# Altium project MainBoard.PrjPCB (part 1 of 2)
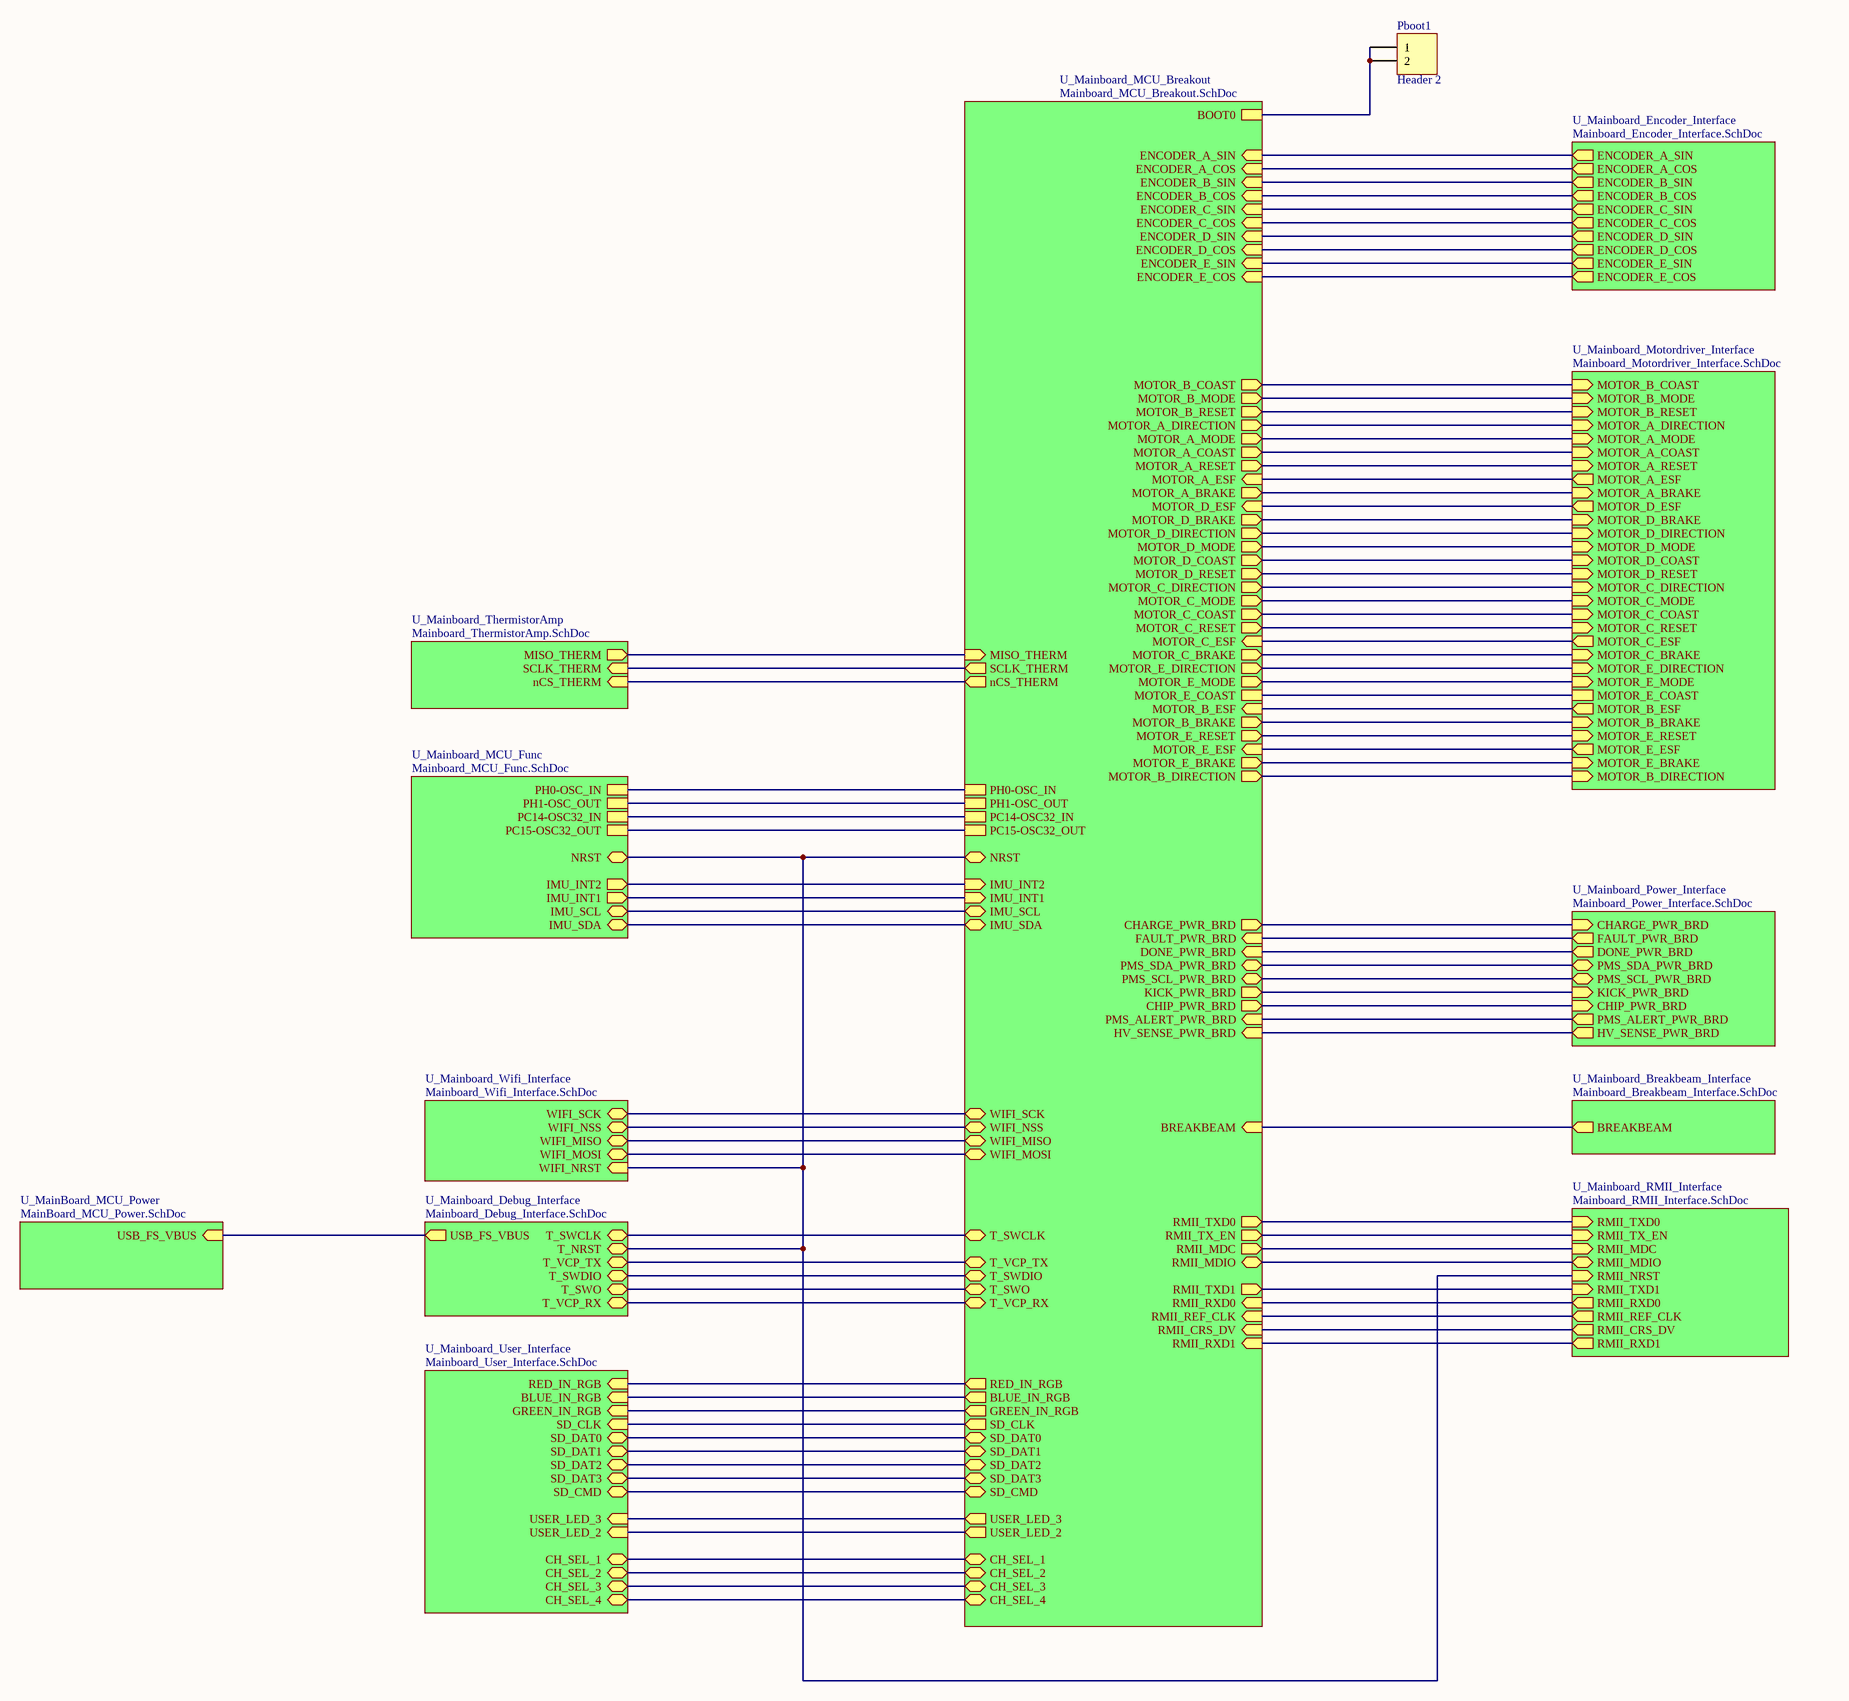
[diagram p0: MainBoard_Top.SchDoc]
12 sheets, 215 parts. Net scope: hierarchical (ports join the sheet entries above them; power ports are global).
Board files: MainBoard_Layout_V2.PcbDoc, Mainboard_Layout_V2_Working_Matthew.PcbDoc, Mainboard_Layout_V2_Working_Taylor.PcbDoc, Mainboard_Layout_V2_Working_Dannon.PcbDoc
Sheets:
  MainBoard_Top.SchDoc
    U_Mainboard_Encoder_Interface = Mainboard_Encoder_Interface.SchDoc
    U_Mainboard_Motordriver_Interface = Mainboard_Motordriver_Interface.SchDoc
    U_Mainboard_RMII_Interface = Mainboard_RMII_Interface.SchDoc
    U_Mainboard_Wifi_Interface = Mainboard_Wifi_Interface.SchDoc
    U_Mainboard_Breakbeam_Interface = Mainboard_Breakbeam_Interface.SchDoc
    U_MainBoard_MCU_Power = MainBoard_MCU_Power.SchDoc
    U_Mainboard_Debug_Interface = Mainboard_Debug_Interface.SchDoc
    U_Mainboard_User_Interface = Mainboard_User_Interface.SchDoc
    U_Mainboard_MCU_Breakout = Mainboard_MCU_Breakout.SchDoc
    U_Mainboard_MCU_Func = Mainboard_MCU_Func.SchDoc
    U_Mainboard_ThermistorAmp = Mainboard_ThermistorAmp.SchDoc

## Sheet MainBoard_Top.SchDoc
size C

### Parts
Pboot1  Header 2  [HDR1X2]

### Sub-sheets
U_Mainboard_Breakbeam_Interface = Mainboard_Breakbeam_Interface.SchDoc: BREAKBEAM (out)
U_Mainboard_Debug_Interface = Mainboard_Debug_Interface.SchDoc: USB_FS_VBUS (out), T_SWCLK (bidir), T_NRST (bidir), T_VCP_TX (bidir), T_SWDIO (bidir), T_SWO (bidir), T_VCP_RX (bidir)
U_Mainboard_Encoder_Interface = Mainboard_Encoder_Interface.SchDoc: ENCODER_A_SIN (out), ENCODER_E_SIN (out), ENCODER_B_COS (out), ENCODER_C_COS (out), ENCODER_A_COS (out), ENCODER_D_SIN (out), ENCODER_D_COS (out), ENCODER_E_COS (out), ENCODER_B_SIN (out), ENCODER_C_SIN (out)
U_Mainboard_MCU_Breakout = Mainboard_MCU_Breakout.SchDoc: BOOT0, T_SWCLK (bidir), T_VCP_TX (bidir), T_SWDIO (bidir), T_SWO (bidir), T_VCP_RX (bidir), RED_IN_RGB (out), BLUE_IN_RGB (out), GREEN_IN_RGB (out), SD_CLK (out), SD_DAT0 (bidir), SD_DAT1 (bidir), SD_DAT2 (bidir), SD_DAT3 (bidir), SD_CMD (bidir), CH_SEL_1 (bidir), CH_SEL_2 (bidir), CH_SEL_3 (bidir), CH_SEL_4 (bidir), ENCODER_A_SIN (in), ENCODER_A_COS (in), ENCODER_B_SIN (in), ENCODER_B_COS (in), ENCODER_C_SIN (in), ENCODER_C_COS (in), ENCODER_D_SIN (in), ENCODER_D_COS (in), ENCODER_E_SIN (in), ENCODER_E_COS (in), USER_LED_3 (out), USER_LED_2 (out), WIFI_MOSI (bidir), WIFI_MISO (bidir), WIFI_NSS (bidir), WIFI_SCK (bidir), PC15-OSC32_OUT, PC14-OSC32_IN, PH1-OSC_OUT, NRST (bidir), PH0-OSC_IN, IMU_INT2 (in), IMU_INT1 (in), BREAKBEAM (in), RMII_TXD0 (out), RMII_TX_EN (out), RMII_MDC (out), RMII_MDIO (bidir), RMII_TXD1 (out), RMII_RXD0 (in), RMII_REF_CLK (in), RMII_CRS_DV (in), RMII_RXD1 (in), HV_SENSE_PWR_BRD (in), PMS_ALERT_PWR_BRD (in), CHIP_PWR_BRD (out), KICK_PWR_BRD (out), PMS_SCL_PWR_BRD (bidir), PMS_SDA_PWR_BRD (bidir), DONE_PWR_BRD (in), FAULT_PWR_BRD (in), CHARGE_PWR_BRD (out), MOTOR_B_COAST (out), MOTOR_B_MODE (out), MOTOR_B_RESET (out), MOTOR_A_DIRECTION (out), MOTOR_A_MODE (out), MOTOR_A_COAST (out), MOTOR_A_RESET (out), MOTOR_A_ESF (in), MOTOR_D_ESF (in), MOTOR_A_BRAKE (out), MOTOR_D_BRAKE (out), MOTOR_D_DIRECTION (out), MOTOR_D_MODE (out), MOTOR_D_COAST (out), MOTOR_D_RESET (out), MOTOR_C_DIRECTION (out), MOTOR_C_MODE (out), MOTOR_C_COAST (out), MOTOR_C_RESET (out), MOTOR_C_ESF (in), MOTOR_C_BRAKE (out), MOTOR_E_DIRECTION (out), MOTOR_E_MODE (out), MOTOR_E_COAST, MOTOR_B_ESF (in), MOTOR_B_BRAKE (out), MOTOR_E_RESET (out), MOTOR_E_ESF (in), MOTOR_E_BRAKE (out), MOTOR_B_DIRECTION (out), IMU_SDA (bidir), IMU_SCL (bidir), nCS_THERM (out), SCLK_THERM (out), MISO_THERM (in)
U_Mainboard_MCU_Func = Mainboard_MCU_Func.SchDoc: NRST (bidir), IMU_SCL (bidir), IMU_SDA (bidir), IMU_INT1 (out), IMU_INT2 (out), PH0-OSC_IN, PH1-OSC_OUT, PC14-OSC32_IN, PC15-OSC32_OUT
U_MainBoard_MCU_Power = MainBoard_MCU_Power.SchDoc: USB_FS_VBUS (in)
U_Mainboard_Motordriver_Interface = Mainboard_Motordriver_Interface.SchDoc: MOTOR_B_COAST (in), MOTOR_B_MODE (in), MOTOR_B_RESET (in), MOTOR_A_DIRECTION (in), MOTOR_A_MODE (in), MOTOR_A_COAST (in), MOTOR_A_RESET (in), MOTOR_A_ESF (out), MOTOR_A_BRAKE (in), MOTOR_D_ESF (out), MOTOR_D_BRAKE (in), MOTOR_D_DIRECTION (in), MOTOR_D_MODE (in), MOTOR_D_COAST (in), MOTOR_D_RESET (in), MOTOR_C_DIRECTION (in), MOTOR_C_MODE (in), MOTOR_C_COAST (in), MOTOR_C_RESET (in), MOTOR_C_ESF (out), MOTOR_C_BRAKE (in), MOTOR_E_DIRECTION (in), MOTOR_E_MODE (in), MOTOR_E_COAST, MOTOR_B_ESF (out), MOTOR_B_BRAKE (in), MOTOR_E_RESET (in), MOTOR_E_ESF (out), MOTOR_E_BRAKE (in), MOTOR_B_DIRECTION (in)
U_Mainboard_Power_Interface = Mainboard_Power_Interface.SchDoc (file not in this document): CHARGE_PWR_BRD (in), FAULT_PWR_BRD (out), DONE_PWR_BRD (out), PMS_SDA_PWR_BRD (bidir), PMS_SCL_PWR_BRD (bidir), KICK_PWR_BRD (in), CHIP_PWR_BRD (in), PMS_ALERT_PWR_BRD (out), HV_SENSE_PWR_BRD (out)
U_Mainboard_RMII_Interface = Mainboard_RMII_Interface.SchDoc: RMII_TXD0 (in), RMII_TX_EN (in), RMII_RXD0 (out), RMII_REF_CLK (out), RMII_CRS_DV (out), RMII_MDC (in), RMII_MDIO (bidir), RMII_NRST (in), RMII_TXD1 (in), RMII_RXD1 (out)
U_Mainboard_ThermistorAmp = Mainboard_ThermistorAmp.SchDoc: nCS_THERM (in), MISO_THERM (out), SCLK_THERM (in)
U_Mainboard_User_Interface = Mainboard_User_Interface.SchDoc: RED_IN_RGB (in), BLUE_IN_RGB (in), GREEN_IN_RGB (in), SD_CLK (in), SD_DAT0 (bidir), SD_DAT1 (bidir), SD_DAT2 (bidir), SD_DAT3 (bidir), SD_CMD (bidir), USER_LED_3 (in), USER_LED_2 (in), CH_SEL_1 (bidir), CH_SEL_2 (bidir), CH_SEL_3 (bidir), CH_SEL_4 (bidir)
U_Mainboard_Wifi_Interface = Mainboard_Wifi_Interface.SchDoc: WIFI_SCK (bidir), WIFI_NSS (bidir), WIFI_MISO (bidir), WIFI_MOSI (bidir), WIFI_NRST (in)

### Nets
Cos1: sheet U_Mainboard_Encoder_Interface/ENCODER_B_COS, sheet U_Mainboard_MCU_Breakout/ENCODER_B_COS
Cos2: sheet U_Mainboard_Encoder_Interface/ENCODER_A_COS, sheet U_Mainboard_MCU_Breakout/ENCODER_A_COS
Cos3: sheet U_Mainboard_Encoder_Interface/ENCODER_C_COS, sheet U_Mainboard_MCU_Breakout/ENCODER_C_COS
Cos4: sheet U_Mainboard_Encoder_Interface/ENCODER_D_COS, sheet U_Mainboard_MCU_Breakout/ENCODER_D_COS
NRST: sheet U_Mainboard_RMII_Interface/RMII_NRST, sheet U_Mainboard_Wifi_Interface/WIFI_NRST, sheet U_Mainboard_Debug_Interface/T_NRST, sheet U_Mainboard_MCU_Breakout/NRST, sheet U_Mainboard_MCU_Func/NRST
PC14-OSC32_IN: sheet U_Mainboard_MCU_Breakout/PC14-OSC32_IN, sheet U_Mainboard_MCU_Func/PC14-OSC32_IN
PC15-OSC32_OUT: sheet U_Mainboard_MCU_Breakout/PC15-OSC32_OUT, sheet U_Mainboard_MCU_Func/PC15-OSC32_OUT
PH0-OSC_IN: sheet U_Mainboard_MCU_Breakout/PH0-OSC_IN, sheet U_Mainboard_MCU_Func/PH0-OSC_IN
PH1-OSC_OUT: sheet U_Mainboard_MCU_Breakout/PH1-OSC_OUT, sheet U_Mainboard_MCU_Func/PH1-OSC_OUT
RMII_MDIO: sheet U_Mainboard_RMII_Interface/RMII_MDIO, sheet U_Mainboard_MCU_Breakout/RMII_MDIO
RMII_REF_CLK: sheet U_Mainboard_RMII_Interface/RMII_REF_CLK, sheet U_Mainboard_MCU_Breakout/RMII_REF_CLK
RMII_TX_EN: sheet U_Mainboard_RMII_Interface/RMII_TX_EN, sheet U_Mainboard_MCU_Breakout/RMII_TX_EN
RMII_TXD0: sheet U_Mainboard_RMII_Interface/RMII_TXD0, sheet U_Mainboard_MCU_Breakout/RMII_TXD0
RMII_TXD1: sheet U_Mainboard_RMII_Interface/RMII_TXD1, sheet U_Mainboard_MCU_Breakout/RMII_TXD1
Sin1: sheet U_Mainboard_Encoder_Interface/ENCODER_B_SIN, sheet U_Mainboard_MCU_Breakout/ENCODER_B_SIN
Sin2: sheet U_Mainboard_Encoder_Interface/ENCODER_A_SIN, sheet U_Mainboard_MCU_Breakout/ENCODER_A_SIN
Sin3: sheet U_Mainboard_Encoder_Interface/ENCODER_C_SIN, sheet U_Mainboard_MCU_Breakout/ENCODER_C_SIN
Sin4: sheet U_Mainboard_Encoder_Interface/ENCODER_D_SIN, sheet U_Mainboard_MCU_Breakout/ENCODER_D_SIN
NetD6_2: sheet U_Mainboard_User_Interface/RED_IN_RGB, sheet U_Mainboard_MCU_Breakout/RED_IN_RGB
NetD6_3: sheet U_Mainboard_User_Interface/BLUE_IN_RGB, sheet U_Mainboard_MCU_Breakout/BLUE_IN_RGB
NetD6_4: sheet U_Mainboard_User_Interface/GREEN_IN_RGB, sheet U_Mainboard_MCU_Breakout/GREEN_IN_RGB
NetF1_1: sheet U_MainBoard_MCU_Power/USB_FS_VBUS, sheet U_Mainboard_Debug_Interface/USB_FS_VBUS
NetJ7_A17: sheet U_Mainboard_Motordriver_Interface/MOTOR_A_BRAKE, sheet U_Mainboard_MCU_Breakout/MOTOR_A_BRAKE
NetJ7_A18: sheet U_Mainboard_Motordriver_Interface/MOTOR_A_ESF, sheet U_Mainboard_MCU_Breakout/MOTOR_A_ESF
NetJ7_B15: sheet U_Mainboard_Motordriver_Interface/MOTOR_A_RESET, sheet U_Mainboard_MCU_Breakout/MOTOR_A_RESET
NetJ7_B16: sheet U_Mainboard_Motordriver_Interface/MOTOR_A_COAST, sheet U_Mainboard_MCU_Breakout/MOTOR_A_COAST
NetJ7_B17: sheet U_Mainboard_Motordriver_Interface/MOTOR_A_MODE, sheet U_Mainboard_MCU_Breakout/MOTOR_A_MODE
NetJ7_B18: sheet U_Mainboard_Motordriver_Interface/MOTOR_A_DIRECTION, sheet U_Mainboard_MCU_Breakout/MOTOR_A_DIRECTION
NetJ8_A17: sheet U_Mainboard_Motordriver_Interface/MOTOR_C_BRAKE, sheet U_Mainboard_MCU_Breakout/MOTOR_C_BRAKE
NetJ8_A18: sheet U_Mainboard_Motordriver_Interface/MOTOR_C_ESF, sheet U_Mainboard_MCU_Breakout/MOTOR_C_ESF
NetJ8_B15: sheet U_Mainboard_Motordriver_Interface/MOTOR_C_RESET, sheet U_Mainboard_MCU_Breakout/MOTOR_C_RESET
NetJ8_B16: sheet U_Mainboard_Motordriver_Interface/MOTOR_C_COAST, sheet U_Mainboard_MCU_Breakout/MOTOR_C_COAST
NetJ8_B17: sheet U_Mainboard_Motordriver_Interface/MOTOR_C_MODE, sheet U_Mainboard_MCU_Breakout/MOTOR_C_MODE
NetJ8_B18: sheet U_Mainboard_Motordriver_Interface/MOTOR_C_DIRECTION, sheet U_Mainboard_MCU_Breakout/MOTOR_C_DIRECTION
NetJ9_A17: sheet U_Mainboard_Motordriver_Interface/MOTOR_E_BRAKE, sheet U_Mainboard_MCU_Breakout/MOTOR_E_BRAKE
NetJ9_A18: sheet U_Mainboard_Motordriver_Interface/MOTOR_E_ESF, sheet U_Mainboard_MCU_Breakout/MOTOR_E_ESF
NetJ9_B15: sheet U_Mainboard_Motordriver_Interface/MOTOR_E_RESET, sheet U_Mainboard_MCU_Breakout/MOTOR_E_RESET
NetJ9_B16: sheet U_Mainboard_Motordriver_Interface/MOTOR_E_COAST, sheet U_Mainboard_MCU_Breakout/MOTOR_E_COAST
NetJ9_B17: sheet U_Mainboard_Motordriver_Interface/MOTOR_E_MODE, sheet U_Mainboard_MCU_Breakout/MOTOR_E_MODE
NetJ9_B18: sheet U_Mainboard_Motordriver_Interface/MOTOR_E_DIRECTION, sheet U_Mainboard_MCU_Breakout/MOTOR_E_DIRECTION
NetJ10_A17: sheet U_Mainboard_Motordriver_Interface/MOTOR_B_BRAKE, sheet U_Mainboard_MCU_Breakout/MOTOR_B_BRAKE
NetJ10_A18: sheet U_Mainboard_Motordriver_Interface/MOTOR_B_ESF, sheet U_Mainboard_MCU_Breakout/MOTOR_B_ESF
NetJ10_B15: sheet U_Mainboard_Motordriver_Interface/MOTOR_B_RESET, sheet U_Mainboard_MCU_Breakout/MOTOR_B_RESET
NetJ10_B16: sheet U_Mainboard_Motordriver_Interface/MOTOR_B_COAST, sheet U_Mainboard_MCU_Breakout/MOTOR_B_COAST
NetJ10_B17: sheet U_Mainboard_Motordriver_Interface/MOTOR_B_MODE, sheet U_Mainboard_MCU_Breakout/MOTOR_B_MODE
NetJ10_B18: sheet U_Mainboard_Motordriver_Interface/MOTOR_B_DIRECTION, sheet U_Mainboard_MCU_Breakout/MOTOR_B_DIRECTION
NetJ11_A17: sheet U_Mainboard_Motordriver_Interface/MOTOR_D_BRAKE, sheet U_Mainboard_MCU_Breakout/MOTOR_D_BRAKE
NetJ11_A18: sheet U_Mainboard_Motordriver_Interface/MOTOR_D_ESF, sheet U_Mainboard_MCU_Breakout/MOTOR_D_ESF
NetJ11_B15: sheet U_Mainboard_Motordriver_Interface/MOTOR_D_RESET, sheet U_Mainboard_MCU_Breakout/MOTOR_D_RESET
NetJ11_B16: sheet U_Mainboard_Motordriver_Interface/MOTOR_D_COAST, sheet U_Mainboard_MCU_Breakout/MOTOR_D_COAST
NetJ11_B17: sheet U_Mainboard_Motordriver_Interface/MOTOR_D_MODE, sheet U_Mainboard_MCU_Breakout/MOTOR_D_MODE
NetJ11_B18: sheet U_Mainboard_Motordriver_Interface/MOTOR_D_DIRECTION, sheet U_Mainboard_MCU_Breakout/MOTOR_D_DIRECTION
NetJ12_2: sheet U_Mainboard_Breakbeam_Interface/BREAKBEAM, sheet U_Mainboard_MCU_Breakout/BREAKBEAM
NetJ13_1: sheet U_Mainboard_User_Interface/SD_DAT2, sheet U_Mainboard_MCU_Breakout/SD_DAT2
NetJ13_2: sheet U_Mainboard_User_Interface/SD_DAT3, sheet U_Mainboard_MCU_Breakout/SD_DAT3
NetJ13_3: sheet U_Mainboard_User_Interface/SD_CMD, sheet U_Mainboard_MCU_Breakout/SD_CMD
NetJ13_5: sheet U_Mainboard_User_Interface/SD_CLK, sheet U_Mainboard_MCU_Breakout/SD_CLK
NetJ13_7: sheet U_Mainboard_User_Interface/SD_DAT0, sheet U_Mainboard_MCU_Breakout/SD_DAT0
NetJ13_8: sheet U_Mainboard_User_Interface/SD_DAT1, sheet U_Mainboard_MCU_Breakout/SD_DAT1
NetPboot1_1: Pboot1.1 Pboot1.2 ; sheet U_Mainboard_MCU_Breakout/BOOT0
NetPwifi1_3: sheet U_Mainboard_Wifi_Interface/WIFI_MOSI, sheet U_Mainboard_MCU_Breakout/WIFI_MOSI
NetPwifi1_4: sheet U_Mainboard_Wifi_Interface/WIFI_MISO, sheet U_Mainboard_MCU_Breakout/WIFI_MISO
NetPwifi1_5: sheet U_Mainboard_Wifi_Interface/WIFI_NSS, sheet U_Mainboard_MCU_Breakout/WIFI_NSS
NetPwifi1_6: sheet U_Mainboard_Wifi_Interface/WIFI_SCK, sheet U_Mainboard_MCU_Breakout/WIFI_SCK
NetR63_2: sheet U_Mainboard_RMII_Interface/RMII_RXD0, sheet U_Mainboard_MCU_Breakout/RMII_RXD0
NetR64_2: sheet U_Mainboard_RMII_Interface/RMII_RXD1, sheet U_Mainboard_MCU_Breakout/RMII_RXD1
NetR66_2: sheet U_Mainboard_RMII_Interface/RMII_CRS_DV, sheet U_Mainboard_MCU_Breakout/RMII_CRS_DV
NetR84_2: sheet U_Mainboard_User_Interface/USER_LED_3, sheet U_Mainboard_MCU_Breakout/USER_LED_3
NetR85_2: sheet U_Mainboard_User_Interface/USER_LED_2, sheet U_Mainboard_MCU_Breakout/USER_LED_2
NetS2_1A: sheet U_Mainboard_User_Interface/CH_SEL_1, sheet U_Mainboard_MCU_Breakout/CH_SEL_1
NetS2_2A: sheet U_Mainboard_User_Interface/CH_SEL_2, sheet U_Mainboard_MCU_Breakout/CH_SEL_2
NetS2_3A: sheet U_Mainboard_User_Interface/CH_SEL_3, sheet U_Mainboard_MCU_Breakout/CH_SEL_3
NetS2_4A: sheet U_Mainboard_User_Interface/CH_SEL_4, sheet U_Mainboard_MCU_Breakout/CH_SEL_4
NetU8_13: sheet U_Mainboard_RMII_Interface/RMII_MDC, sheet U_Mainboard_MCU_Breakout/RMII_MDC
NetU9_4: sheet U_Mainboard_MCU_Breakout/IMU_INT1, sheet U_Mainboard_MCU_Func/IMU_INT1
NetU9_9: sheet U_Mainboard_MCU_Breakout/IMU_INT2, sheet U_Mainboard_MCU_Func/IMU_INT2
NetU9_13: sheet U_Mainboard_MCU_Breakout/IMU_SCL, sheet U_Mainboard_MCU_Func/IMU_SCL
NetU9_14: sheet U_Mainboard_MCU_Breakout/IMU_SDA, sheet U_Mainboard_MCU_Func/IMU_SDA
NetU10_4: sheet U_Mainboard_Debug_Interface/T_SWDIO, sheet U_Mainboard_MCU_Breakout/T_SWDIO
NetU10_6: sheet U_Mainboard_Debug_Interface/T_SWO, sheet U_Mainboard_MCU_Breakout/T_SWO
NetU10_12: sheet U_Mainboard_Debug_Interface/T_VCP_TX, sheet U_Mainboard_MCU_Breakout/T_VCP_TX
NetU10_13: sheet U_Mainboard_Debug_Interface/T_SWCLK, sheet U_Mainboard_MCU_Breakout/T_SWCLK
NetU10_15: sheet U_Mainboard_Debug_Interface/T_VCP_RX, sheet U_Mainboard_MCU_Breakout/T_VCP_RX
NetU11_1: sheet U_Mainboard_Power_Interface/KICK_PWR_BRD, sheet U_Mainboard_MCU_Breakout/KICK_PWR_BRD
NetU11_2: sheet U_Mainboard_Power_Interface/FAULT_PWR_BRD, sheet U_Mainboard_MCU_Breakout/FAULT_PWR_BRD
NetU11_3: sheet U_Mainboard_Power_Interface/DONE_PWR_BRD, sheet U_Mainboard_MCU_Breakout/DONE_PWR_BRD
NetU11_4: sheet U_Mainboard_Power_Interface/HV_SENSE_PWR_BRD, sheet U_Mainboard_MCU_Breakout/HV_SENSE_PWR_BRD
NetU11_21: sheet U_Mainboard_Encoder_Interface/ENCODER_E_COS, sheet U_Mainboard_MCU_Breakout/ENCODER_E_COS
NetU11_22: sheet U_Mainboard_Encoder_Interface/ENCODER_E_SIN, sheet U_Mainboard_MCU_Breakout/ENCODER_E_SIN
NetU11_135: sheet U_Mainboard_Power_Interface/PMS_ALERT_PWR_BRD, sheet U_Mainboard_MCU_Breakout/PMS_ALERT_PWR_BRD
NetU11_136: sheet U_Mainboard_Power_Interface/PMS_SCL_PWR_BRD, sheet U_Mainboard_MCU_Breakout/PMS_SCL_PWR_BRD
NetU11_137: sheet U_Mainboard_Power_Interface/PMS_SDA_PWR_BRD, sheet U_Mainboard_MCU_Breakout/PMS_SDA_PWR_BRD
NetU11_141: sheet U_Mainboard_Power_Interface/CHIP_PWR_BRD, sheet U_Mainboard_MCU_Breakout/CHIP_PWR_BRD
NetU11_142: sheet U_Mainboard_Power_Interface/CHARGE_PWR_BRD, sheet U_Mainboard_MCU_Breakout/CHARGE_PWR_BRD
NetU12_5: sheet U_Mainboard_MCU_Breakout/nCS_THERM, sheet U_Mainboard_ThermistorAmp/nCS_THERM
NetU12_6: sheet U_Mainboard_MCU_Breakout/MISO_THERM, sheet U_Mainboard_ThermistorAmp/MISO_THERM
NetU12_7: sheet U_Mainboard_MCU_Breakout/SCLK_THERM, sheet U_Mainboard_ThermistorAmp/SCLK_THERM

### Library data of the parts
Pboot1 = Header 2: Header, 2-Pin; LatestRevisionDate: 17-Jul-2002; LatestRevisionNote: Re-released for DXP Platform.; Publisher: Altium Limited

## Sheet Mainboard_Encoder_Interface.SchDoc
size 381 x 254 mm
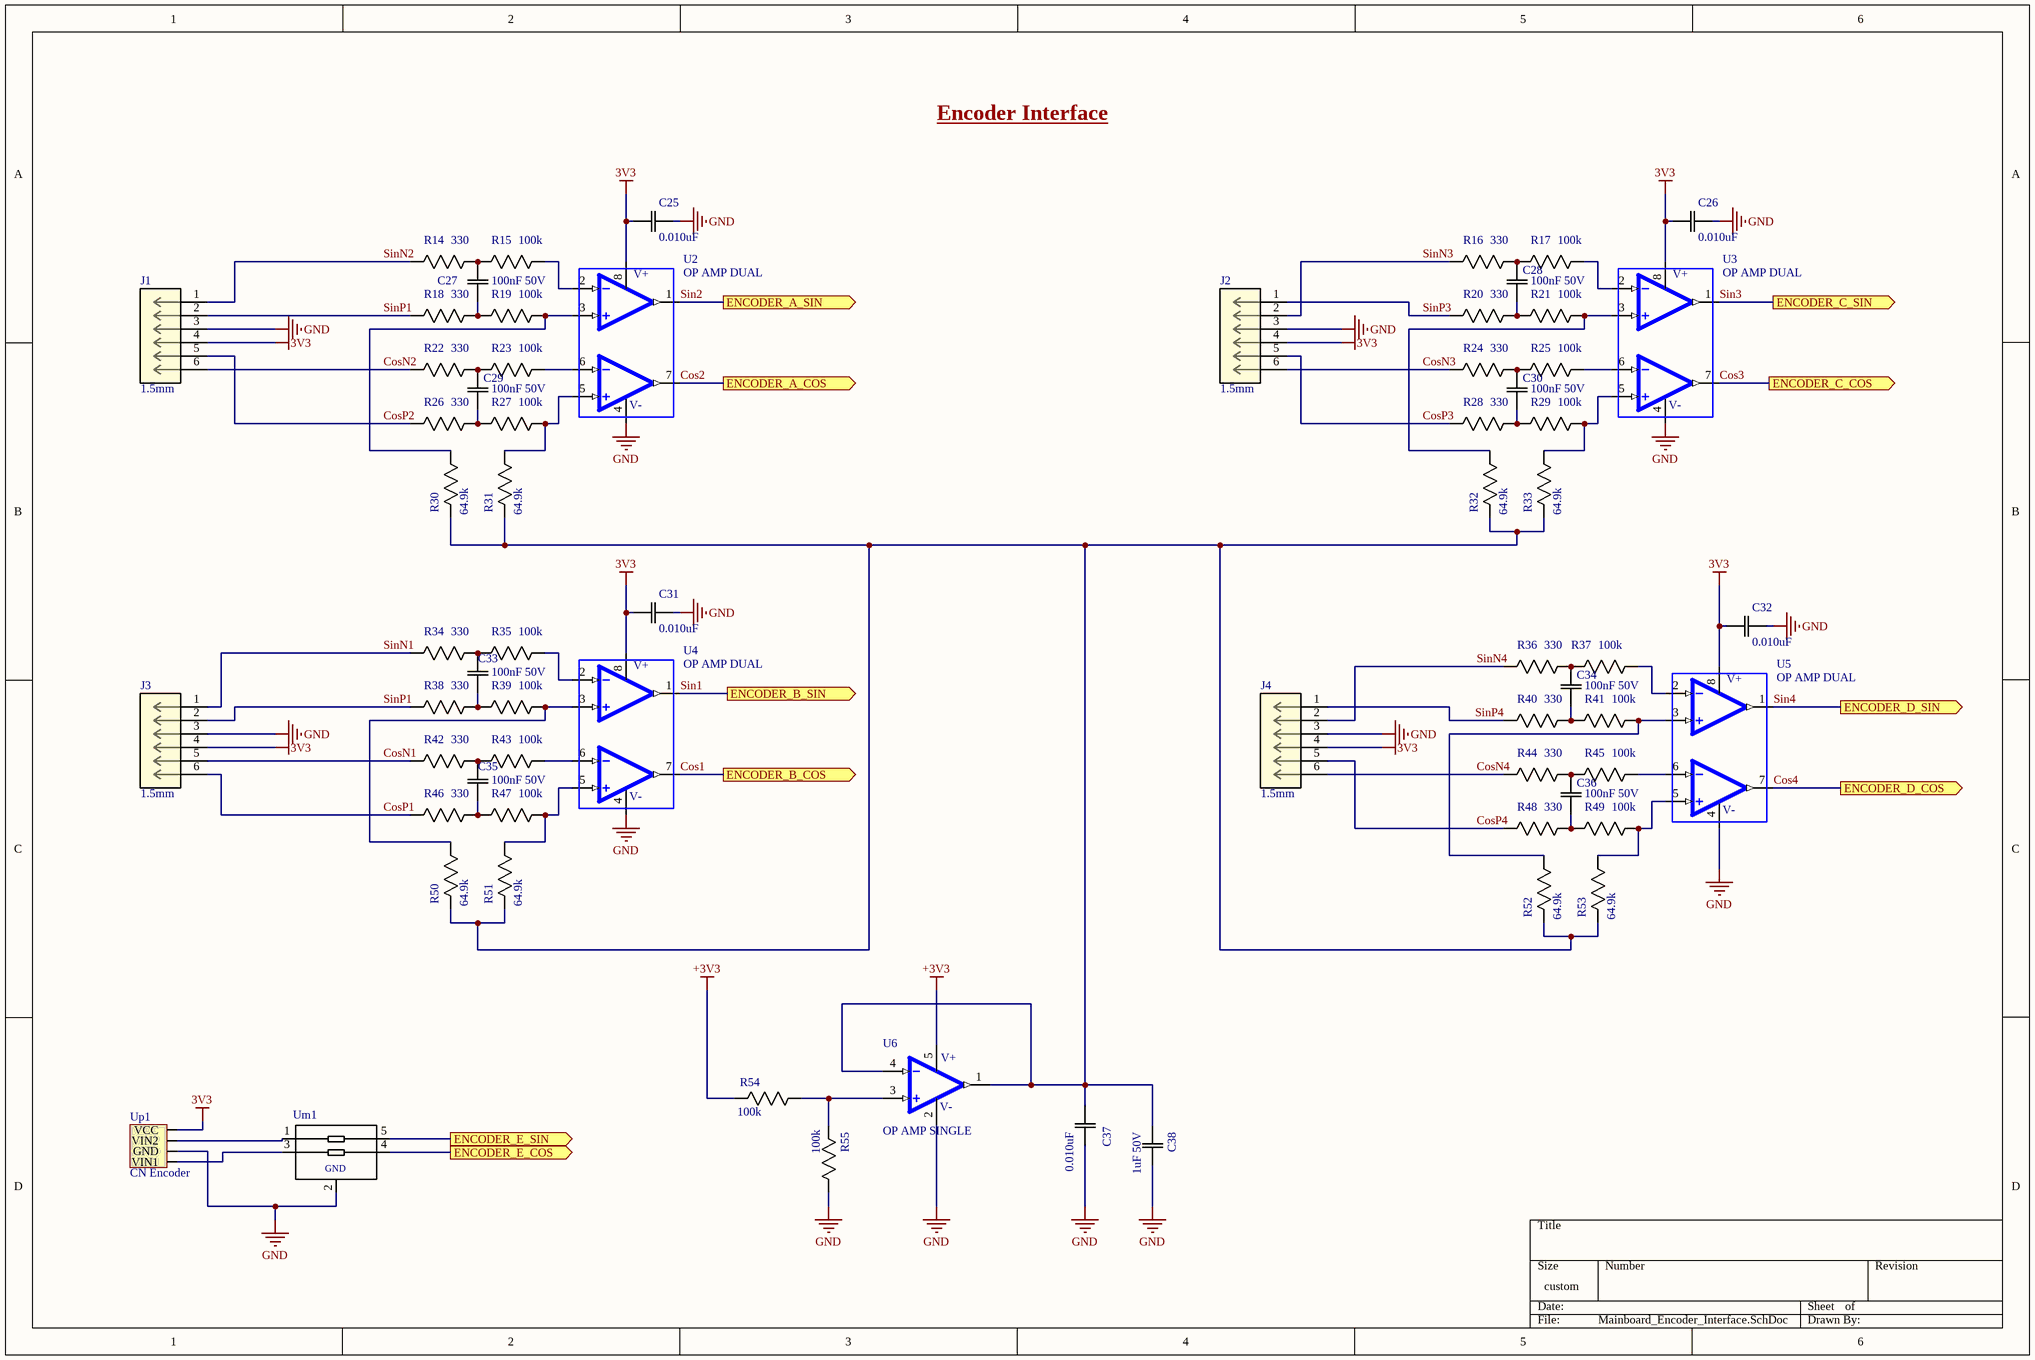
[diagram p1: Mainboard_Encoder_Interface.SchDoc]

### Parts
C25  0.010uF  [0805]
C26  0.010uF  [0805]
C27  100nF 50V  [0805]
C28  100nF 50V  [0805]
C29  100nF 50V  [0805]
C30  100nF 50V  [0805]
C31  0.010uF  [0805]
C32  0.010uF  [0805]
C33  100nF 50V  [0805]
C34  100nF 50V  [0805]
C35  100nF 50V  [0805]
C36  100nF 50V  [0805]
C37  0.010uF  [0805]
C38  1uF 50V  [0805]
J1  1.5mm  [6POS JST]
J2  1.5mm  [6POS JST]
J3  1.5mm  [6POS JST]
J4  1.5mm  [6POS JST]
R14  330  [0805]
R15  100k  [0805]
R16  330  [0805]
R17  100k  [0805]
R18  330  [0805]
R19  100k  [0805]
R20  330  [0805]
R21  100k  [0805]
R22  330  [0805]
R23  100k  [0805]
R24  330  [0805]
R25  100k  [0805]
R26  330  [0805]
R27  100k  [0805]
R28  330  [0805]
R29  100k  [0805]
R30  64.9k  [0805]
R31  64.9k  [0805]
R32  64.9k  [0805]
R33  64.9k  [0805]
R34  330  [0805]
R35  100k  [0805]
R36  330  [0805]
R37  100k  [0805]
R38  330  [0805]
R39  100k  [0805]
R40  330  [0805]
R41  100k  [0805]
R42  330  [0805]
R43  100k  [0805]
R44  330  [0805]
R45  100k  [0805]
R46  330  [0805]
R47  100k  [0805]
R48  330  [0805]
R49  100k  [0805]
R50  64.9k  [0805]
R51  64.9k  [0805]
R52  64.9k  [0805]
R53  64.9k  [0805]
R54  100k  [0805]
R55  100k  [0805]
U2  OP AMP DUAL  [8-MSOP]
U3  OP AMP DUAL  [8-MSOP]
U4  OP AMP DUAL  [8-MSOP]
U5  OP AMP DUAL  [8-MSOP]
U6  OP AMP SINGLE  [SOT95P280X145-5N]
Um1  EMI  [SOT-665]  (value not drawn)
Up1  CN Encoder  [EncoderConnector]

### Ports
ENCODER_A_COS (out), ENCODER_A_SIN (out), ENCODER_B_COS (out), ENCODER_B_SIN (out), ENCODER_C_COS (out), ENCODER_C_SIN (out), ENCODER_D_COS (out), ENCODER_D_SIN (out), ENCODER_E_COS (out), ENCODER_E_SIN (out)

### Nets
3V3: C25.1(C1) C26.1(C1) C31.1(C1) C32.1(C1) J1.4 J2.4 J3.4 J4.4 U2.8(V+) U3.8(V+) U4.8(V+) U5.8(V+) Up1.VCC
+3V3: R54.2(R2) U6.5(V+)
GND: C25.2(C2) C26.2(C2) C31.2(C2) C32.2(C2) C37.2(C2) C38.2(C2) J1.3 J2.3 J3.3 J4.3 R55.1(R1) U2.4(V-) U3.4(V-) U4.4(V-) U5.4(V-) U6.2(V-) Um1.2(P$2) Up1.GND
Cos1: U4.7(OUTB) ; port ENCODER_B_COS
Cos2: U2.7(OUTB) ; port ENCODER_A_COS
Cos3: U3.7(OUTB) ; port ENCODER_C_COS
Cos4: U5.7(OUTB) ; port ENCODER_D_COS
CosN1: J3.5 R42.2(R2)
CosN2: J1.6 R22.2(R2)
CosN3: J2.6 R24.2(R2)
CosN4: J4.6 R44.2(R2)
CosP1: J3.6 R46.2(R2)
CosP2: J1.5 R26.2(R2)
CosP3: J2.5 R28.2(R2)
CosP4: J4.5 R48.2(R2)
Sin1: U4.1(OUTA) ; port ENCODER_B_SIN
Sin2: U2.1(OUTA) ; port ENCODER_A_SIN
Sin3: U3.1(OUTA) ; port ENCODER_C_SIN
Sin4: U5.1(OUTA) ; port ENCODER_D_SIN
SinN1: J3.1 R34.2(R2)
SinN2: J1.1 R14.2(R2)
SinN3: J2.2 R16.2(R2)
SinN4: J4.2 R36.2(R2)
SinP1: J1.2 J3.2 R18.2(R2) R38.2(R2)
SinP3: J2.1 R20.2(R2)
SinP4: J4.1 R40.2(R2)
NetC27_1: C27.1(C1) R14.1(R1) R15.2(R2)
NetC27_2: C27.2(C2) R18.1(R1) R19.2(R2)
NetC28_1: C28.1(C1) R16.1(R1) R17.2(R2)
NetC28_2: C28.2(C2) R20.1(R1) R21.2(R2)
NetC29_1: C29.1(C1) R22.1(R1) R23.2(R2)
NetC29_2: C29.2(C2) R26.1(R1) R27.2(R2)
NetC30_1: C30.1(C1) R24.1(R1) R25.2(R2)
NetC30_2: C30.2(C2) R28.1(R1) R29.2(R2)
NetC33_1: C33.1(C1) R34.1(R1) R35.2(R2)
NetC33_2: C33.2(C2) R38.1(R1) R39.2(R2)
NetC34_1: C34.1(C1) R36.1(R1) R37.2(R2)
NetC34_2: C34.2(C2) R40.1(R1) R41.2(R2)
NetC35_1: C35.1(C1) R42.1(R1) R43.2(R2)
NetC35_2: C35.2(C2) R46.1(R1) R47.2(R2)
NetC36_1: C36.1(C1) R44.1(R1) R45.2(R2)
NetC36_2: C36.2(C2) R48.1(R1) R49.2(R2)
NetC37_1: C37.1(C1) C38.1(C1) R30.2(R2) R31.2(R2) R32.2(R2) R33.2(R2) R50.2(R2) R51.2(R2) R52.2(R2) R53.2(R2) U6.1(OUT) U6.4(IN-)
NetR15_1: R15.1(R1) U2.2(INA-)
NetR17_1: R17.1(R1) U3.2(INA-)
NetR19_1: R19.1(R1) R30.1(R1) U2.3(INA+)
NetR21_1: R21.1(R1) R32.1(R1) U3.3(INA+)
NetR23_1: R23.1(R1) U2.6(INB-)
NetR25_1: R25.1(R1) U3.6(INB-)
NetR27_1: R27.1(R1) R31.1(R1) U2.5(INB+)
NetR29_1: R29.1(R1) R33.1(R1) U3.5(INB+)
NetR35_1: R35.1(R1) U4.2(INA-)
NetR37_1: R37.1(R1) U5.2(INA-)
NetR39_1: R39.1(R1) R50.1(R1) U4.3(INA+)
NetR41_1: R41.1(R1) R52.1(R1) U5.3(INA+)
NetR43_1: R43.1(R1) U4.6(INB-)
NetR45_1: R45.1(R1) U5.6(INB-)
NetR47_1: R47.1(R1) R51.1(R1) U4.5(INB+)
NetR49_1: R49.1(R1) R53.1(R1) U5.5(INB+)
NetR54_1: R54.1(R1) R55.2(R2) U6.3(IN+)
NetU11_21: Um1.4(P$4) ; port ENCODER_E_COS
NetU11_22: Um1.5(P$5) ; port ENCODER_E_SIN
NetUm1_1: Um1.1(P$1) Up1.VIN2
NetUm1_3: Um1.3(P$3) Up1.VIN1

### Notes on the sheet
- Encoder Interface
- (in symbol EMI FILTER IP4256CZ5-W) GND

### Library data of the parts
C25 C26 C31 C32 C37 = CAP 0.010uF 50V: CAP CER 0.010UF 50V X7R 0603/0805; Tolerance: 10%; Package: 0603/0805; Value: 0.010uF; Rating: 50V; Temperature Coefficient: X7R; Operating Temperature: -55°C ~ 125°C
C27-C30 C33-C36 = CAP 100nF 50V: CAP CER 0.1UF 50V X7R 0805; Tolerance: 10%; Package: 0805; Value: 100nF; Rating: 50V
C38 = CAP 1uF 50V: CAP CER 1UF 50V X7R 0805; Tolerance: 10%; Package: 0805; Value: 1uF; Rating: 50V; Temperature Coefficient: X7R; Operating Temperature: -55°C ~ 125°C
J1-J4 = CN 6POS JST RA: Conn Shrouded Header HDR 6 POS 1.5mm Solder RA Thru-Hole Box; Manufacturer: JST; Manufacturer Part Number: S6B-ZR(LF)(SN); Body Plating: Tin; Number of Positions: 6; Current Rating: 1A; Connector Type: Header,Male Pin; Contact Resistance: 30mR; Voltage Rating: 50V; Gender: Male; Insulation Resistance: 500MR; Panel Thickness: 3.5mm; Supplier 1: Digi-Key; RoHS: Yes; Category: Headers and Wire Housings; Stock 1: 14808; Mount: Through Hole; Number of Pins: 6; Color: White; Contact Plating: Tin,Copper; Contact Material: Brass,Tin,Copper; Housing Color: Beige; Housing Material: Polyamide; Material: Nylon; Contact Shape: Circular; Insulation Material: Nylon; Insulation Color: Natural; Min Operating Temperature: -25°C; Max Operating Temperature: 85°C; Number of Rows: 1; Packaging: Bulk; Termination: Solder; Fastening Type: Detent; Number of Contacts: 6; Max Voltage Rating (AC): 50V; Max Current Rating: 1A; Orientation: Right Angle; Voltage Rating (AC): 50V; Voltage Rating (DC): 50V; Length: 10.5mm; Width: 3.5mm; Height: 7.2mm; Pitch: 1.5mm; Depth: 6mm; Lead Pitch: 1.5mm; Contact Mating Length: 0.094inch; Lead Free: Lead Free; Flammability Rating: UL94 V-0; REACH SVHC: No SVHC; ComponentLink1URL: https://datasheet.ciiva.com/8052/80556-8052225.pdf?src-supplier=Element14; ComponentLink1Description: https://datasheet.ciiva.com/8052/80556-8052225.pdf?src-supplier=Element14; ComponentLink2URL: https://datasheet.ciiva.com/25617/0900766b81147f94-25617345.pdf?src-supplier=RSComponents; ComponentLink2Description: https://datasheet.ciiva.com/25617/0900766b81147f94-25617345.pdf?src-supplier=RSComponents; ComponentLink3URL: https://datasheet.ciiva.com/11752/0900766b8082f593-11752194.pdf?src-supplier=RSComponents; ComponentLink3Description: https://datasheet.ciiva.com/11752/0900766b8082f593-11752194.pdf?src-supplier=RSComponents; ComponentLink4URL: https://datasheet.ciiva.com/26894/getdatasheetpartid-642095-26894637.pdf?src-supplier=Verical; ComponentLink4Description: https://datasheet.ciiva.com/26894/getdatasheetpartid-642095-26894637.pdf?src-supplier=Verical; ComponentLink5URL: https://datasheet.ciiva.com/712/ezh-712560.pdf?src-supplier=Digi-Key; ComponentLink5Description: https://datasheet.ciiva.com/712/ezh-712560.pdf?src-supplier=Digi-Key; ComponentLink6URL: https://datasheet.ciiva.com/16484/s6b-zrlfsn-16484554.pdf?src-supplier=Future+Electronics; ComponentLink6Description: https://datasheet.ciiva.com/16484/s6b-zrlfsn-16484554.pdf?src-supplier=Future+Electronics; Supplier Part Number 1: 455-1673-ND
R14 R16 R18 R20 R22 R24 R26 R28 R34 R36 R38 R40 R42 R44 R46 R48 = RES 330.0 1/8W - 1%: RES SMD 330 OHM 1% 1/8W 0805; Rating: 0.125W; Package: 0805; Value: 330; Tolerance: 1%
R15 R17 R19 R21 R23 R25 R27 R29 R35 R37 R39 R41 R43 R45 R47 R49 R54 R55 = RES 100k 1/8W - 1%: RES SMD 100K OHM 1% 1/8W 0805; Power (Watts): 0.125W; Package: 0805; Value: 100k; Tolerance: 1%
R30-R33 R50-R53 = RES 64.9k 1/8W: RES SMD 64.9K OHM 1% 1/8W 0805; Power (Watts): 0.125W; Package: 0805; Value: 64.9k; Tolerance: 1%; ComponentLink1Description: digikey; ComponentLink1URL: https://www.digikey.ca/en/products/detail/yageo/RC0805FR-0764K9L/728090
U2-U5 = OP AMP DUAL: IC OPAMP VFB 50KHZ RRO 8MSOP; Manufacturer: Analog Devices; Manufacturer Part Number: ADA4505-2ARMZ; Common Mode Rejection Ratio: 105dB; Max Supply Voltage: 5V; Min Supply Voltage: 1.8V; Max Dual Supply Voltage: 2.5V; Min Dual Supply Voltage: 900mV; Voltage Gain: 120dB; Operating Supply Voltage: 3V; Slew Rate: 0.006V/µs; Input Offset Voltage (Vos): 3mV; Input Bias Current: 0.5pA; Operating Supply Current: 14uA; Number of Channels: 2; Power Supply Rejection Ratio (PSRR): 110dB; Output Current per Channel: 40mA; Quiescent Current: 7uA; Input Capacitance: 4.7pF; Supply Type: Single,Dual; Supplier 1: Digi-Key; RoHS: Yes; Category: Amplifiers - Op Amps, Buffer, Instrumentation; Stock 1: 767; Case/Package: MSOP; Number of Pins: 8; Contact Plating: Tin,Matte; Min Operating Temperature: -40°C; Max Operating Temperature: 125°C; Gain Bandwidth Product: 50kHz; Packaging: Rail/Tube; Package Quantity: 50; Unity Gain Bandwidth Product: 50kHz; Number of Circuits: 2; Number of Elements: 2; Number of Amplifiers: 2; Max Input Voltage: 5V; Nominal Supply Current: 7uA; Bandwidth: 50kHz; Length: 3.2mm; Width: 3.2mm; Height: 0.95mm; Lead Free: Contains Lead; REACH SVHC: No SVHC; ComponentLink1URL: https://datasheet.ciiva.com/24017/ada4505-1-4505-2-4505-4-249280-24017665.pdf?src-supplier=Mouser; ComponentLink1Description: https://datasheet.ciiva.com/24017/ada4505-1-4505-2-4505-4-249280-24017665.pdf?src-supplier=Mouser; ComponentLink2URL: https://datasheet.ciiva.com/2974/ada4505-1-4505-2-4505-4-2974772.pdf?src-supplier=Avnet; ComponentLink2Description: https://datasheet.ciiva.com/2974/ada4505-1-4505-2-4505-4-2974772.pdf?src-supplier=Avnet; ComponentLink3URL: https://datasheet.ciiva.com/17569/ada4505-1-4505-2-4505-4-17569270.pdf?src-supplier=Avnet+Europe; ComponentLink3Description: https://datasheet.ciiva.com/17569/ada4505-1-4505-2-4505-4-17569270.pdf?src-supplier=Avnet+Europe; ComponentLink4URL: https://datasheet.ciiva.com/1805/ada4505-1-4505-2-4505-4-1805784.pdf?src-supplier=Digi-Key; ComponentLink4Description: https://datasheet.ciiva.com/1805/ada4505-1-4505-2-4505-4-1805784.pdf?src-supplier=Digi-Key; Supplier Part Number 1: ADA4505-2ARMZ-ND
U6 = OP AMP SINGLE: ANALOG DEVICES - ADA4505-1ARJZ-R7 - IC, AMPLIF. OPER., R-R, CMOS, SOT23-5; Min Supply Voltage: 1.8V; Max Supply Voltage: 5V; Min Dual Supply Voltage: 900mV; Max Dual Supply Voltage: 2.5V; Voltage Gain: 120dB; Common Mode Rejection Ratio: 105dB; Gain Bandwidth Product: 50kHz; Slew Rate: 0.006V/µs; Operating Supply Voltage: 3V; Number of Circuits: 1; Input Bias Current: 500nA; Input Offset Voltage (Vos): 3mV; Operating Supply Current: 9uA; Output Current per Channel: 40mA; Power Supply Rejection Ratio (PSRR): 110dB; Input Capacitance: 4.7pF; Supplier 1: Digi-Key; Manufacturer: Analog Devices; Manufacturer Part Number: ADA4505-1ARJZ-R7; RoHS: Yes; Category: Amplifiers - Op Amps, Buffer, Instrumentation; Stock 1: 3416; Case/Package: SOT-23-5; Number of Pins: 5; Contact Plating: Tin,Matte; Min Operating Temperature: -40°C; Max Operating Temperature: 125°C; Bandwidth: 50kHz; Packaging: Tape and Reel; Package Quantity: 3000; Unity Gain Bandwidth Product: 50kHz; Number of Channels: 1; Number of Elements: 1; Number of Amplifiers: 1; Quiescent Current: 9uA; REACH SVHC: No SVHC; Lead Free: Contains Lead; ComponentLink1URL: https://datasheet.ciiva.com/22712/1610797-22712032.pdf?src-supplier=Element14; ComponentLink1Description: https://datasheet.ciiva.com/22712/1610797-22712032.pdf?src-supplier=Element14; ComponentLink2URL: https://datasheet.ciiva.com/23805/608874-23805844.pdf?src-supplier=Newark; ComponentLink2Description: https://datasheet.ciiva.com/23805/608874-23805844.pdf?src-supplier=Newark; ComponentLink3URL: https://datasheet.ciiva.com/1487/1610797-1487372.pdf?src-supplier=Element14; ComponentLink3Description: https://datasheet.ciiva.com/1487/1610797-1487372.pdf?src-supplier=Element14; Supplier Part Number 1: ADA4505-1ARJZ-R7CT-ND
Um1 = EMI FILTER IP4256CZ5-W: FILTER RC(PI) 100 OHM/19PF SMD; MF: Nexperia USA Inc.; MP: IP4256CZ5-W,115; SnapEDA_Link: https://www.snapeda.com/parts/IP4256CZ5-W/Nexperia%20USA%20Inc./view-part/3605439/?ref=snap; Price: 0.17 CAD; Package: SOT-665; Digikey: 1727-4718-1-ND; Digikey Link: https://www.digikey.ca/product-detail/en/nexperia-usa-inc/IP4256CZ5-W115/1727-4718-1-ND/2531158; Supplier 1: Digi-Key; Supplier Part Number 1: 1727-4718-1-ND
Up1 = CN HDR 4POS: CN HDR R/A 4POS 1.5MM; MF: JST Sales America Inc.; MP: S4B-ZR(LF)(SN); Rating: 1A; Digikey: 455-1671-ND; Digikey Link: https://www.digikey.ca/products/en?keywords=455-1671-ND; Price: 0.324 CAD; Package: N/A; Value: N/A; Supplier 1: Digi-Key; Supplier Part Number 1: 455-1671-ND

## Sheet Mainboard_Motordriver_Interface.SchDoc
size A4
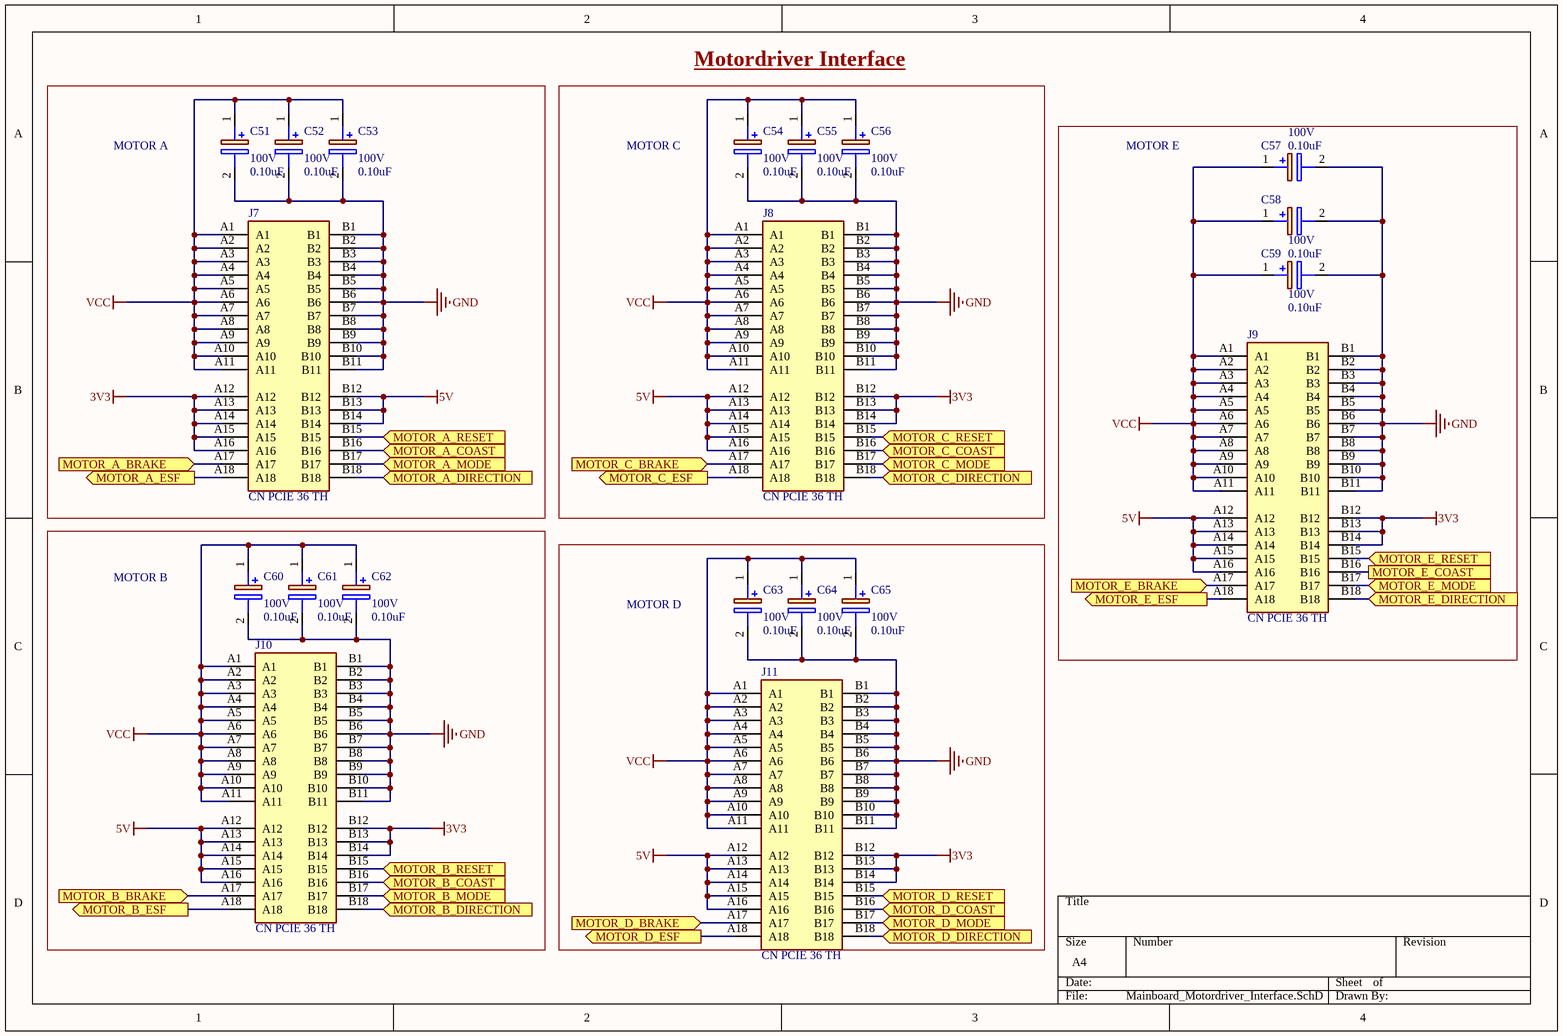
[diagram p2: Mainboard_Motordriver_Interface.SchDoc]

### Parts
C51  value 0.10uF  Rating: 100V  [0603]  (hidden comment: CAP POL 0.1uF 100V)
C52  value 0.10uF  Rating: 100V  [0603]  (hidden comment: CAP POL 0.1uF 100V)
C53  value 0.10uF  Rating: 100V  [0603]  (hidden comment: CAP POL 0.1uF 100V)
C54  value 0.10uF  Rating: 100V  [0603]  (hidden comment: CAP POL 0.1uF 100V)
C55  value 0.10uF  Rating: 100V  [0603]  (hidden comment: CAP POL 0.1uF 100V)
C56  value 0.10uF  Rating: 100V  [0603]  (hidden comment: CAP POL 0.1uF 100V)
C57  value 0.10uF  Rating: 100V  [0603]  (hidden comment: CAP POL 0.1uF 100V)
C58  value 0.10uF  Rating: 100V  [0603]  (hidden comment: CAP POL 0.1uF 100V)
C59  value 0.10uF  Rating: 100V  [0603]  (hidden comment: CAP POL 0.1uF 100V)
C60  value 0.10uF  Rating: 100V  [0603]  (hidden comment: CAP POL 0.1uF 100V)
C61  value 0.10uF  Rating: 100V  [0603]  (hidden comment: CAP POL 0.1uF 100V)
C62  value 0.10uF  Rating: 100V  [0603]  (hidden comment: CAP POL 0.1uF 100V)
C63  value 0.10uF  Rating: 100V  [0603]  (hidden comment: CAP POL 0.1uF 100V)
C64  value 0.10uF  Rating: 100V  [0603]  (hidden comment: CAP POL 0.1uF 100V)
C65  value 0.10uF  Rating: 100V  [0603]  (hidden comment: CAP POL 0.1uF 100V)
J7  CN PCIE 36 TH  [CN PCIE 36 TH]
J8  CN PCIE 36 TH  [CN PCIE 36 TH]
J9  CN PCIE 36 TH  [CN PCIE 36 TH]
J10  CN PCIE 36 TH  [CN PCIE 36 TH]
J11  CN PCIE 36 TH  [CN PCIE 36 TH]

### Blocks framed on the sheet
MOTOR A: C51-C53 J7
Motordriver Interface: C54-C56 J8
MOTOR E: C57-C59 J9
MOTOR B: C60-C62 J10
MOTOR D: C63-C65 J11

### Ports
MOTOR_A_BRAKE (in), MOTOR_A_COAST (in), MOTOR_A_DIRECTION (in), MOTOR_A_ESF (out), MOTOR_A_MODE (in), MOTOR_A_RESET (in), MOTOR_B_BRAKE (in), MOTOR_B_COAST (in), MOTOR_B_DIRECTION (in), MOTOR_B_ESF (out), MOTOR_B_MODE (in), MOTOR_B_RESET (in), MOTOR_C_BRAKE (in), MOTOR_C_COAST (in), MOTOR_C_DIRECTION (in), MOTOR_C_ESF (out), MOTOR_C_MODE (in), MOTOR_C_RESET (in), MOTOR_D_BRAKE (in), MOTOR_D_COAST (in), MOTOR_D_DIRECTION (in), MOTOR_D_ESF (out), MOTOR_D_MODE (in), MOTOR_D_RESET (in), MOTOR_E_BRAKE (in), MOTOR_E_COAST, MOTOR_E_DIRECTION (in), MOTOR_E_ESF (out), MOTOR_E_MODE (in), MOTOR_E_RESET (in)

### Nets
3V3: J7.A12 J7.A13 J7.A14 J7.A15 J7.A16 J8.B12 J8.B13 J8.B14 J9.B12 J9.B13 J9.B14 J10.B12 J10.B13 J10.B14 J11.B12 J11.B13 J11.B14
5V: J7.B12 J7.B13 J7.B14 J8.A12 J8.A13 J8.A14 J8.A15 J8.A16 J9.A12 J9.A13 J9.A14 J9.A15 J9.A16 J10.A12 J10.A13 J10.A14 J10.A15 J10.A16 J11.A12 J11.A13 J11.A14 J11.A15 J11.A16
GND: C51.2(-) C52.2(-) C53.2(-) C54.2(-) C55.2(-) C56.2(-) C57.2(-) C58.2(-) C59.2(-) C60.2(-) C61.2(-) C62.2(-) C63.2(-) C64.2(-) C65.2(-) J7.B1 J7.B2 J7.B3 J7.B4 J7.B5 J7.B6 J7.B7 J7.B8 J7.B9 J7.B10 J7.B11 J8.B1 J8.B2 J8.B3 J8.B4 J8.B5 J8.B6 J8.B7 J8.B8 J8.B9 J8.B10 J8.B11 J9.B1 J9.B2 J9.B3 J9.B4 J9.B5 J9.B6 J9.B7 J9.B8 J9.B9 J9.B10 J9.B11 J10.B1 J10.B2 J10.B3 J10.B4 J10.B5 J10.B6 J10.B7 J10.B8 J10.B9 J10.B10 J10.B11 J11.B1 J11.B2 J11.B3 J11.B4 J11.B5 J11.B6 J11.B7 J11.B8 J11.B9 J11.B10 J11.B11
VCC: C51.1(+) C52.1(+) C53.1(+) C54.1(+) C55.1(+) C56.1(+) C57.1(+) C58.1(+) C59.1(+) C60.1(+) C61.1(+) C62.1(+) C63.1(+) C64.1(+) C65.1(+) J7.A1 J7.A2 J7.A3 J7.A4 J7.A5 J7.A6 J7.A7 J7.A8 J7.A9 J7.A10 J7.A11 J8.A1 J8.A2 J8.A3 J8.A4 J8.A5 J8.A6 J8.A7 J8.A8 J8.A9 J8.A10 J8.A11 J9.A1 J9.A2 J9.A3 J9.A4 J9.A5 J9.A6 J9.A7 J9.A8 J9.A9 J9.A10 J9.A11 J10.A1 J10.A2 J10.A3 J10.A4 J10.A5 J10.A6 J10.A7 J10.A8 J10.A9 J10.A10 J10.A11 J11.A1 J11.A2 J11.A3 J11.A4 J11.A5 J11.A6 J11.A7 J11.A8 J11.A9 J11.A10 J11.A11
NetJ7_A17: J7.A17 ; port MOTOR_A_BRAKE
NetJ7_A18: J7.A18 ; port MOTOR_A_ESF
NetJ7_B15: J7.B15 ; port MOTOR_A_RESET
NetJ7_B16: J7.B16 ; port MOTOR_A_COAST
NetJ7_B17: J7.B17 ; port MOTOR_A_MODE
NetJ7_B18: J7.B18 ; port MOTOR_A_DIRECTION
NetJ8_A17: J8.A17 ; port MOTOR_C_BRAKE
NetJ8_A18: J8.A18 ; port MOTOR_C_ESF
NetJ8_B15: J8.B15 ; port MOTOR_C_RESET
NetJ8_B16: J8.B16 ; port MOTOR_C_COAST
NetJ8_B17: J8.B17 ; port MOTOR_C_MODE
NetJ8_B18: J8.B18 ; port MOTOR_C_DIRECTION
NetJ9_A17: J9.A17 ; port MOTOR_E_BRAKE
NetJ9_A18: J9.A18 ; port MOTOR_E_ESF
NetJ9_B15: J9.B15 ; port MOTOR_E_RESET
NetJ9_B16: J9.B16 ; port MOTOR_E_COAST
NetJ9_B17: J9.B17 ; port MOTOR_E_MODE
NetJ9_B18: J9.B18 ; port MOTOR_E_DIRECTION
NetJ10_A17: J10.A17 ; port MOTOR_B_BRAKE
NetJ10_A18: J10.A18 ; port MOTOR_B_ESF
NetJ10_B15: J10.B15 ; port MOTOR_B_RESET
NetJ10_B16: J10.B16 ; port MOTOR_B_COAST
NetJ10_B17: J10.B17 ; port MOTOR_B_MODE
NetJ10_B18: J10.B18 ; port MOTOR_B_DIRECTION
NetJ11_A17: J11.A17 ; port MOTOR_D_BRAKE
NetJ11_A18: J11.A18 ; port MOTOR_D_ESF
NetJ11_B15: J11.B15 ; port MOTOR_D_RESET
NetJ11_B16: J11.B16 ; port MOTOR_D_COAST
NetJ11_B17: J11.B17 ; port MOTOR_D_MODE
NetJ11_B18: J11.B18 ; port MOTOR_D_DIRECTION

### Notes on the sheet
- MOTOR C

### Library data of the parts
C51-C65 = CAP POL 0.1uF 100V: 0.1µF 100V Aluminum Electrolytic Capacitors, Through-Hole, Radial, Can 2000 Hrs @ 85°C; Manufacturer_Name: Nichicon; Manufacturer_Part_Number: UKL2A0R1KDD; Datasheet Link: http://www.mouser.com/ds/2/293/e-ukl-876305.pdf; Height: 12.5mm; Mouser Part Number: 647-UKL2A0R1KDD; Mouser Price/Stock: https://www.mouser.com/Search/Refine.aspx?Keyword=647-UKL2A0R1KDD; Supplier 1: Digi-Key; Supplier Part Number 1: 493-16876-ND
J7-J11 = CN PCIE 36 TH: 36 Position Female Connector PCI Expressâ„¢ Gold 0.039 _1.00mm_ Black 10018784-10210TLF; MF: Amphenol ICC; Price: None; SnapEDA_Link: https://www.snapeda.com/parts/10018784-10210TLF/Amphenol%20FCI/view-part/520950/?ref=snap; Availability: Unavailable; MP: 10018784-10210TLF; Package: None; Value: *

## Sheet Mainboard_RMII_Interface.SchDoc
size A4
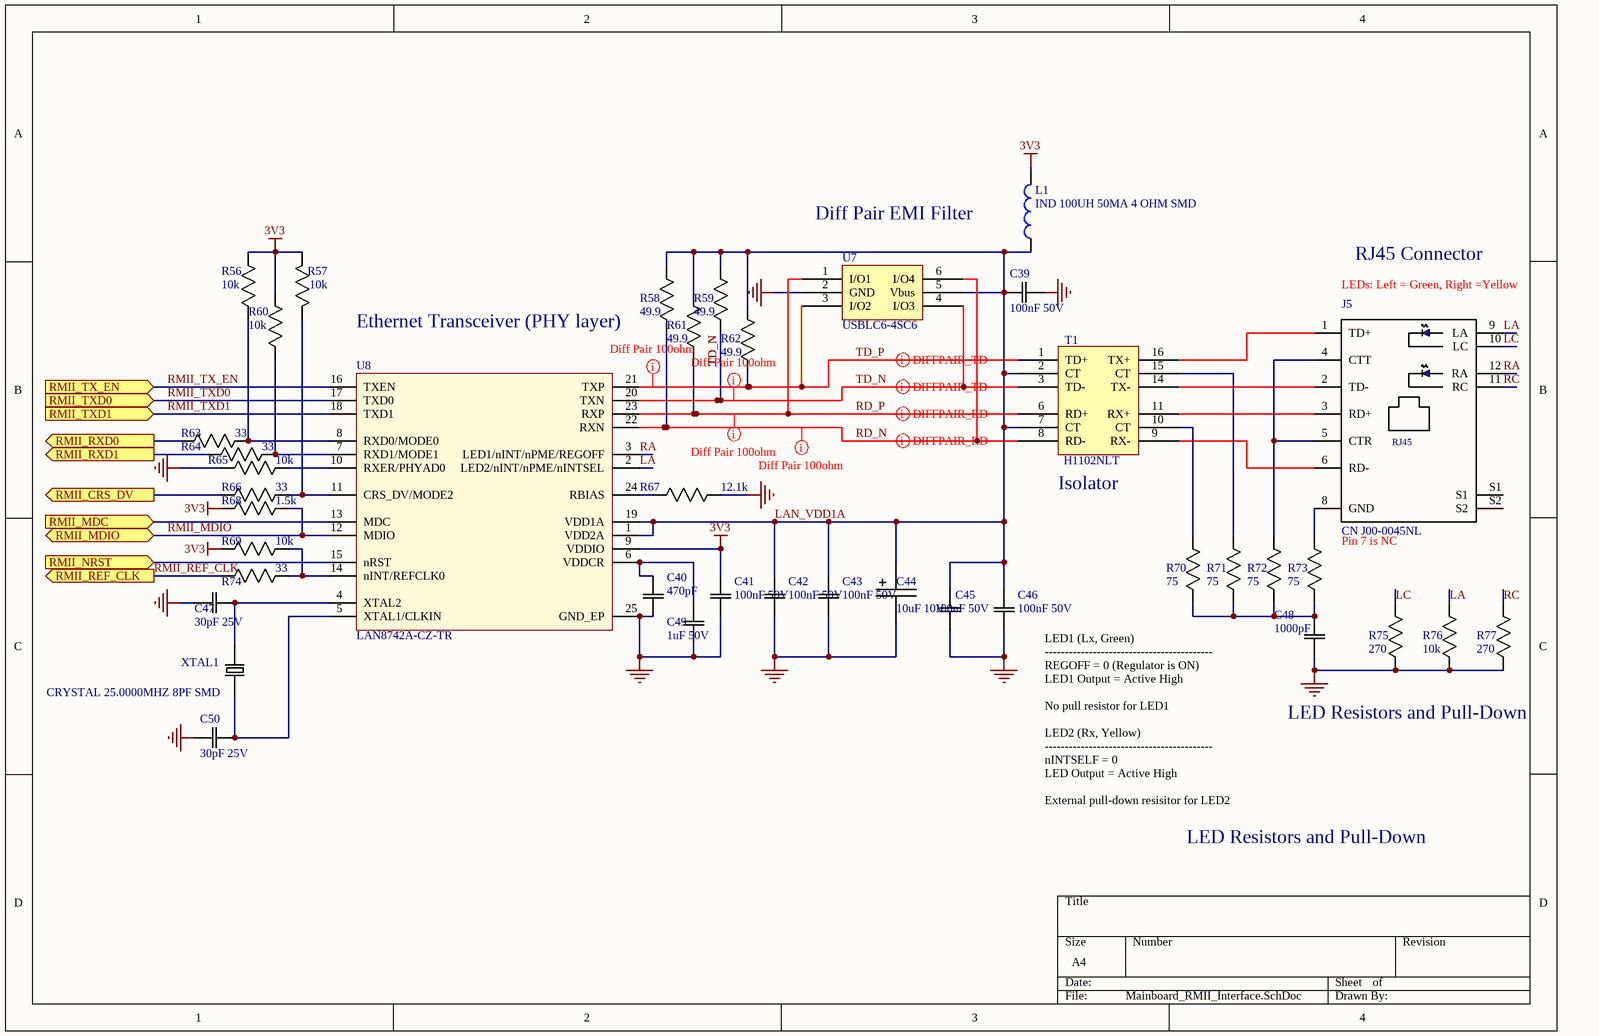
[diagram p3: Mainboard_RMII_Interface.SchDoc]

### Parts
C39  100nF 50V  [0805]
C40  470pF  [0805]
C41  100nF 50V  [0805]
C42  100nF 50V  [0805]
C43  100nF 50V  [0805]
C44  10uF 10V  [1206 Polarized]
C45  100nF 50V  [0805]
C46  100nF 50V  [0805]
C47  30pF 25V  [0805]
C48  1000pF  [0603]
C49  1uF 50V  [0805]
C50  30pF 25V  [0805]
J5  CN J00-0045NL  [RJ45 J00-0045NL]
L1  IND 100UH 50MA 4 OHM SMD  [0805]
R56  10k  [0805]
R57  10k  [0805]
R58  49.9  [0805]
R59  49.9  [0805]
R60  10k  [0805]
R61  49.9  [0805]
R62  49.9  [0805]
R63  33  [0805]
R64  33  [0805]
R65  10k  [0805]
R66  33  [0805]
R67  12.1k  [0805]
R68  1.5k  [0805]
R69  10k  [0805]
R70  75  [0805]
R71  75  [0805]
R72  75  [0805]
R73  75  [0805]
R74  33  [0805]
R75  270  [0805]
R76  10k  [0805]
R77  270  [0805]
T1  H1102NLT  [TRANSFORMER]
U7  USBLC6-4SC6  [SOT23-6L]
U8  LAN8742A-CZ-TR  [24-QFN (4x4)]
XTAL1  CRYSTAL 25.0000MHZ 8PF SMD  [SMD-2]

### Ports
RMII_CRS_DV (out), RMII_MDC (in), RMII_MDIO (bidir), RMII_NRST (in), RMII_REF_CLK (out), RMII_RXD0 (out), RMII_RXD1 (out), RMII_TX_EN (in), RMII_TXD0 (in), RMII_TXD1 (in)

### Nets
3V3: C41.2(C2) L1.2 R56.1(R1) R57.1(R1) R60.1(R1) R68.2(R2) R69.2(R2) U8.9(VDDIO)
GND: C39.2(C2) C40.1(C1) C41.1(C1) C42.1(C1) C43.1(C1) C44.2(P$2) C45.1(C1) C46.1(C1) C47.1(C1) C48.1(C1) C49.1(C1) C50.1(C1) R65.2(R2) R67.1(R1) R75.2(R2) R76.2(R2) R77.2(R2) U7.2(GND) U8.25(GND_EP)
LA: J5.9(LA) R76.1(R1) U8.2(LED2/nINT/nPME/nINTSEL)
LAN_VDD1A: C39.1(C1) C42.2(C2) C43.2(C2) C44.1(P$1) C45.2(C2) C46.2(C2) L1.1 R58.1(R1) R59.1(R1) R61.1(R1) R62.1(R1) T1.2(CT) T1.7(CT) U7.5(Vbus) U8.1(VDD2A) U8.19(VDD1A)
LC: J5.10(LC) R75.1(R1)
NRST: U8.15(nRST) ; port RMII_NRST
RA: J5.12(RA) U8.3(LED1/nINT/nPME/REGOFF)
RC: J5.11(RC) R77.1(R1)
RD_N: R58.2(R2) T1.8(RD-) U7.6(I/O4) U8.22(RXN)
RD_P: R61.2(R2) T1.6(RD+) U7.1(I/O1) U8.23(RXP)
RMII_MDIO: R68.1(R1) U8.12(MDIO) ; port RMII_MDIO
RMII_REF_CLK: R74.2(R2) ; port RMII_REF_CLK
RMII_TX_EN: U8.16(TXEN) ; port RMII_TX_EN
RMII_TXD0: U8.17(TXD0) ; port RMII_TXD0
RMII_TXD1: U8.18(TXD1) ; port RMII_TXD1
TD_N: R59.2(R2) T1.3(TD-) U7.4(I/O3) U8.20(TXN)
TD_P: R62.2(R2) T1.1(TD+) U7.3(I/O2) U8.21(TXP)
NetC40_2: C40.2(C2) C49.2(C2) U8.6(VDDCR)
NetC47_2: C47.2(C2) U8.4(XTAL2) XTAL1.2
NetC48_2: C48.2(C2) R70.2(R2) R71.2(R2) R72.2(R2) R73.2(R2)
NetC50_2: C50.2(C2) U8.5(XTAL1/CLKIN) XTAL1.1
NetJ5_1: J5.1(TD+) T1.16(TX+)
NetJ5_2: J5.2(TD-) T1.14(TX-)
NetJ5_3: J5.3(RD+) T1.11(RX+)
NetJ5_4: J5.4(CTT) J5.5(CTR) R72.1(R1)
NetJ5_6: J5.6(RD-) T1.9(RX-)
NetJ5_8: J5.8(GND) R73.1(R1)
NetR56_2: R56.2(R2) R63.1(R1) U8.8(RXD0/MODE0)
NetR57_2: R57.2(R2) R66.1(R1) U8.11(CRS_DV/MODE2)
NetR60_2: R60.2(R2) R64.1(R1) U8.7(RXD1/MODE1)
NetR63_2: R63.2(R2) ; port RMII_RXD0
NetR64_2: R64.2(R2) ; port RMII_RXD1
NetR65_1: R65.1(R1) U8.10(RXER/PHYAD0)
NetR66_2: R66.2(R2) ; port RMII_CRS_DV
NetR67_2: R67.2(R2) U8.24(RBIAS)
NetR69_1: R69.1(R1) R74.1(R1) U8.14(nINT/REFCLK0)
NetR70_1: R70.1(R1) T1.10(CT)
NetR71_1: R71.1(R1) T1.15(CT)
NetU8_13: U8.13(MDC) ; port RMII_MDC

Not connected (* = marked no-connect by the designer): J5 S1 S2

### Layout directives
differential pair: RD_N, RD_P, TD_N, TD_P
rule Matched Net Lengths [Tolerance = 100mil]: RD_N, RD_P, TD_N, TD_P

### Notes on the sheet
- (near L1) Diff Pair EMI Filter
- (near J5) LEDs: Left = Green, Right =Yellow
- RJ45 Connector
- (near R58) Ethernet Transceiver (PHY layer)
- (near T1) Isolator
- Pin 7 is NC
- LED Resistors and Pull-Down
- LED1 (Lx, Green)
  ------------------------------------------
  REGOFF = 0 (Regulator is ON)
  LED1 Output = Active High
  No pull resistor for LED1
  LED2 (Rx, Yellow)
  ------------------------------------------
  nINTSELF = 0
  LED Output = Active High
  External pull-down resisitor for LED2
- (in symbol CN MAGJACK) RJ45

### Library data of the parts
C39 C41-C43 C45 C46 = CAP 100nF 50V: as C27 on sheet Mainboard_Encoder_Interface; Package: 0805; Value: 100nF; Rating: 50V
C40 = CAP 470pF 50V: CAP CER 470PF 50V X7R 0603/0805; Tolerance: 10%; Package: 0603/0805; Value: 470pF; Rating: 50V; Temperature Coefficient: X7R; Operating Temperature: -55°C ~ 125°C
C44 = CAP TANT 10uF 10V: CAP TANT 10UF 10V 1206; Tolerance: 10%; ESR (Equivalent Series Resistance): 3.8 Ohm; Type: Molded Tantalum; Package: 1206; Value: 10uF; Rating: 10V; Operating Temperature: -55°C ~ 125°C
C47 C50 = CAP 30pF 25V: CAP CER 30PF 25V NP0 0805; Tolerance: 20%; Package: 0805; Value: 30pF; Rating: 25V
C48 = CAP 1000pF 50V: CAP CER 1000PF 50V X7R 0603/0805; Tolerance: 10%; Package: 0603/0805; Value: 1000pF; Rating: 50V; Temperature Coefficient: X7R; Operating Temperature: -55°C ~ 125°C
C49 = CAP 1uF 50V: CAP CER 1UF 50V X7R 0805; Tolerance: 10%; Package: 0805; Value: 1uF; Rating: 50V; Temperature Coefficient: X7R; Operating Temperature: -55°C ~ 125°C
J5 = CN MAGJACK: CN MAGJACK 1PORT 100 BASE-TX; MF: Pulse Electronics; Package: None; SnapEDA_Link: https://www.snapeda.com/parts/J00-0045NL/Pulse%20Electronics%20Network/view-part/87956/?ref=snap; MP: J00-0045NL; Value: *; Digikey Link: https://www.digikey.com/product-detail/en/pulse-electronics-network/J00-0045NL/553-1619-5-ND/1036860?utm_source=snapeda&utm_medium=aggregator&utm_campaign=symbol; Digikey: 553-1619-5-ND; Supplier 1: Mouser; Supplier Part Number 1: 673-J00-0045NL
L1 = IND 100UH 50MA 4 OHM SMD: 100µH Unshielded Wirewound Inductor 50mA 4Ohm 0805 (2012 Metric); MF: Taiyo Yuden; MP: LBR2012T101K; Revision: July-2002: Re-released for DXP Platform.; Value: 100uH; Digikey: 587-2048-1-ND; Digikey Link: https://www.digikey.ca/product-detail/en/taiyo-yuden/LBR2012T101K/587-2048-1-ND/1788995; Supplier 1: Digi-Key; Supplier Part Number 1: 587-4040-1-ND
R56 R57 R60 R65 R69 R76 = RES 10k 1/8W - 1%: RES SMD 10K OHM 1% 1/8W 0805; Power (Watts): 0.125W; Package: 0805; Value: 10k; Tolerance: 1%
R58 R59 R61 R62 = RES 49.9 1/8W: RES SMD 49.9 OHM 1% 1/8W 0805; Power (Watts): 0.125W; Package: 0805; Value: 49.9; Tolerance: 1%
R63 R64 R66 R74 = RES 33.0 1/8W - 1%: RES SMD 33 OHM 1% 1/8W 0805; Power (Watts): 0.125W; Package: 0805; Value: 33; Tolerance: 1%
R67 = RES 12.1k 1/8W: RES SMD 12.1K OHM 1% 1/8W 0805; Power (Watts): 0.125W; Package: 0805; Value: 12.1k; Tolerance: 1%
R68 = RES 1.5k 1/8W - 1%: RES SMD 1.5K OHM 1% 1/8W 0805; Power (Watts): 0.125W; Package: 0805; Value: 1.5k; Tolerance: 1%; ComponentLink1Description: digikey; ComponentLink1URL: https://www.digikey.ca/en/products/detail/panasonic-electronic-components/ERJ-6ENF1022V/111476
R70-R73 = RES 75.0 1/8W - 1%: RES SMD 75 OHM 1% 1/8W 0805; Power (Watts): 0.125W; Package: 0805; Value: 75; Tolerance: 1%
R75 R77 = RES 270.0 1/8W: RES SMD 270 OHM 5% 1/8W 0805; Power (Watts): 0.125W; Package: 0805; Value: 270; Tolerance: 5%
T1 = XFRMR H1102NLT: Isolation and Data Interface (Encapsulated) Pulse Transformer 1:1 Transmitter, 1:1 Receiver Surface Mount; MF: Pulse Electronics; Package: SOIC-16; Price: 7.99 CAD; MP: H1102NL; Digikey: 553-1323-5-ND; Digikey Link: https://www.digikey.ca/en/products/detail/pulse-electronics-network/H1102NL/1036940?s=N4IgTCBcDaIBIEYEAYwDkAyIC6BfIA; Supplier 1: Digi-Key; Supplier Part Number 1: 553-1323-5-ND
U8 = LAN8742A-CZ-TR: LAN8742A-CZ-TR - Small Footprint RMII 10/100 Ethernet, Transceiver with HP Auto-MDIX and flexPWR Technology SQFN-24; MF: Microchip Technology; MP: LAN8742A-CZ-TR; Digikey: LAN8742A-CZ-CT-ND; Digikey Link: https://www.digikey.ca/product-detail/en/microchip-technology/LAN8742A-CZ-TR/LAN8742A-CZ-CT-ND/8256089; Supplier 1: Digi-Key; Supplier Part Number 1: LAN8742A-CZ-CT-ND
XTAL1 = XTAL 25MHZ 8PF SMD: 25MHz ±50ppm Crystal 8pF 70 Ohms 2-SMD, No Lead; MP: NX5032GA-25.000000MHZ-LN-CD-1; MF: NDK America, Inc.; ESR: 70 Ohms; Package: 2-SMD, No Lead; Price: 0.95 CAD; Frequency: 25MHz; Digikey: 644-1041-1-ND; Digikey Link: https://www.digikey.ca/product-detail/en/ndk-america-inc/NX5032GA-25.000000MHZ-LN-CD-1/644-1041-1-ND/1128913; Load Capacitance: 8pF; Supplier 1: Digi-Key; Supplier Part Number 1: 644-1041-1-ND

## Sheet Mainboard_Wifi_Interface.SchDoc
size A4
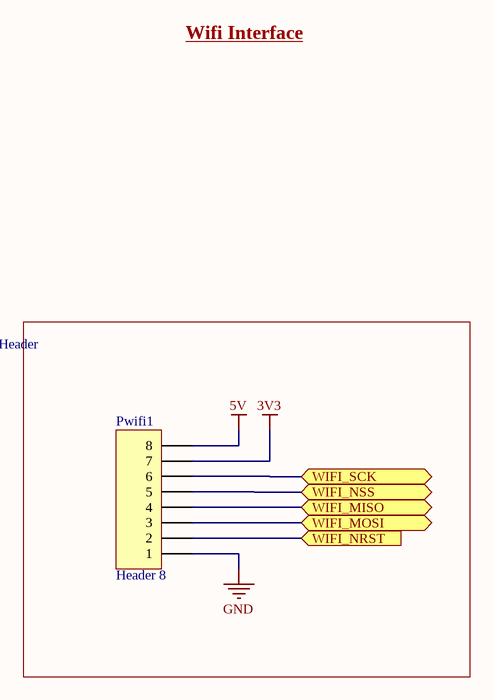
[diagram p4: Mainboard_Wifi_Interface.SchDoc]

### Parts
Pwifi1  Header 8  [HDR1X8]

### Blocks framed on the sheet
Wifi Interface Header: Pwifi1

### Ports
WIFI_MISO (bidir), WIFI_MOSI (bidir), WIFI_NRST (in), WIFI_NSS (bidir), WIFI_SCK (bidir)

### Nets
3V3: Pwifi1.7
5V: Pwifi1.8
GND: Pwifi1.1
NRST: Pwifi1.2 ; port WIFI_NRST
NetPwifi1_3: Pwifi1.3 ; port WIFI_MOSI
NetPwifi1_4: Pwifi1.4 ; port WIFI_MISO
NetPwifi1_5: Pwifi1.5 ; port WIFI_NSS
NetPwifi1_6: Pwifi1.6 ; port WIFI_SCK

### Notes on the sheet
- Wifi Interface

### Library data of the parts
Pwifi1 = Header 8: Header, 8-Pin; LatestRevisionDate: 17-Jul-2002; LatestRevisionNote: Re-released for DXP Platform.; Publisher: Altium Limited

## Sheet Mainboard_Breakbeam_Interface.SchDoc
size A4
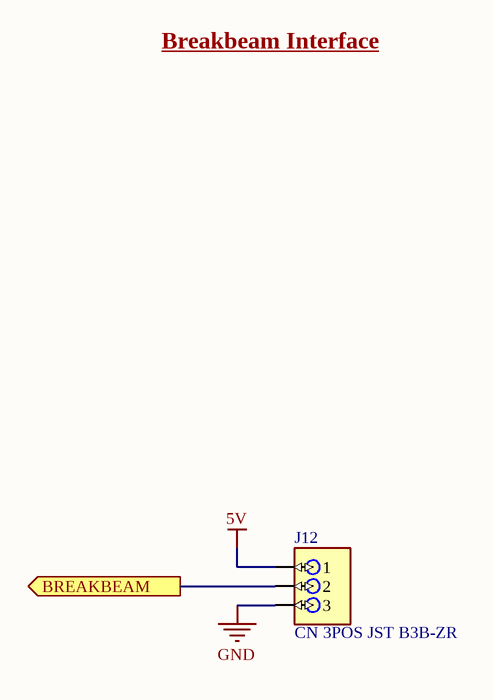
[diagram p5: Mainboard_Breakbeam_Interface.SchDoc]

### Parts
J12  CN 3POS JST B3B-ZR  [CN 3POS JST B3B-ZR]

### Ports
BREAKBEAM (out)

### Nets
5V: J12.1
GND: J12.3
NetJ12_2: J12.2 ; port BREAKBEAM

### Notes on the sheet
- Breakbeam Interface

### Library data of the parts
J12 = CN 3POS JST B3B-ZR: Connector Header Through Hole 3 position 0.059 (1.50mm); MF: JST Sales; Price: $0.18; MP: B3B-ZR; Package: Bulk; Check_prices: https://www.snapeda.com/parts/B3B-ZR/JST%20Sales%20America%20Inc./view-part/496625/?ref=eda; SnapEDA_Link: https://www.snapeda.com/parts/B3B-ZR/JST%20Sales%20America%20Inc./view-part/496625/?ref=snap; Value: *; Availability: Active; ComponentLink1Description: Digikey Link; ComponentLink1URL: https://www.digikey.com/en/products/detail/jst-sales-america-inc/B3B-ZR(LF)(SN)/926565?utm_source=snapeda&utm_medium=aggregator&utm_campaign=buynow

## Sheet MainBoard_MCU_Power.SchDoc
size B
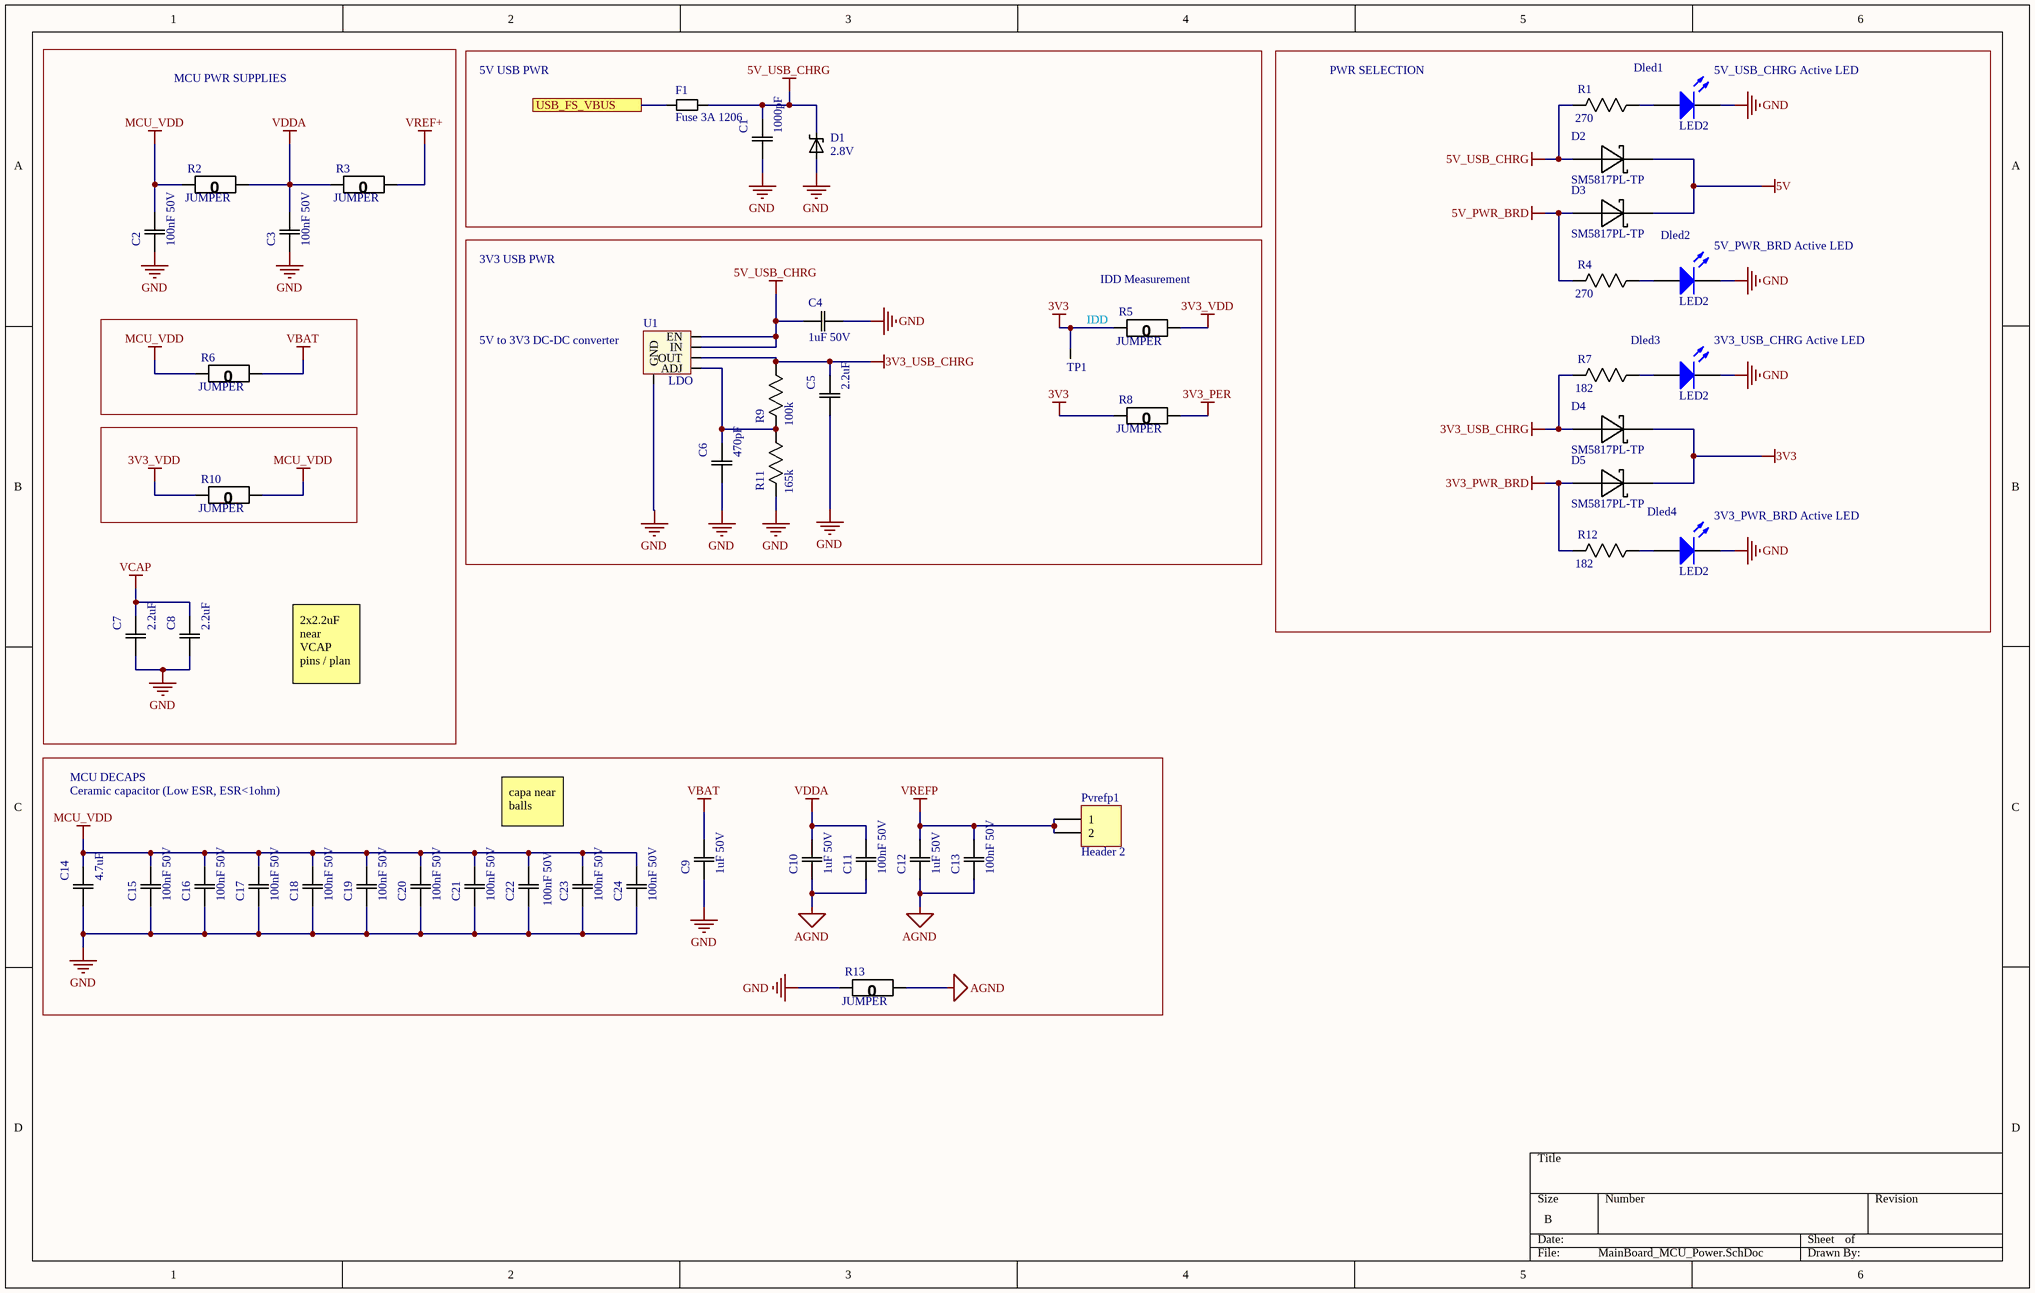
[diagram p6: MainBoard_MCU_Power.SchDoc]

### Parts
C1  1000pF  [0805]
C2  100nF 50V  [0805]
C3  100nF 50V  [0805]
C4  1uF 50V  [0805]
C5  2.2uF  [0805]
C6  470pF  [0805]
C7  2.2uF  [0805]
C8  2.2uF  [0805]
C9  1uF 50V  [0805]
C10  1uF 50V  [0805]
C11  100nF 50V  [0805]
C12  1uF 50V  [0805]
C13  100nF 50V  [0805]
C14  4.7uF  [0805]
C15  100nF 50V  [0805]
C16  100nF 50V  [0805]
C17  100nF 50V  [0805]
C18  100nF 50V  [0805]
C19  100nF 50V  [0805]
C20  100nF 50V  [0805]
C21  100nF 50V  [0805]
C22  100nF 50V  [0805]
C23  100nF 50V  [0805]
C24  100nF 50V  [0805]
D1  2.8V  [SOD-123]
D2  SM5817PL-TP  [SOD-123]
D3  SM5817PL-TP  [SOD-123]
D4  SM5817PL-TP  [SOD-123]
D5  SM5817PL-TP  [SOD-123]
Dled1  LED2  [3.2X1.6X1.1]
Dled2  LED2  [3.2X1.6X1.1]
Dled3  LED2  [3.2X1.6X1.1]
Dled4  LED2  [3.2X1.6X1.1]
F1  Fuse 3A 1206  [1206]
Pvrefp1  Header 2  [HDR1X2]
R1  270  [0805]
R2  JUMPER  [0805]
R3  JUMPER  [0805]
R4  270  [0805]
R5  JUMPER  [0805]
R6  JUMPER  [0805]
R7  182  [0805]
R8  JUMPER  [0805]
R9  100k  [0805]
R10  JUMPER  [0805]
R11  165k  [0805]
R12  182  [0805]
R13  JUMPER  [0805]
TP1  Test Point (Via)  [TP]  (value not drawn)
U1  LDO  [REG LIN POS ADJ 500MA 8SOIC]

### Blocks framed on the sheet
MCU PWR SUPPLIES: C2 C3 C7 C8 R2 R3 R6 R10
5V USB PWR: C1 D1 F1

### Ports
USB_FS_VBUS

### Nets
3V3: D4.C(K) D5.C(K) R5.2(R2) R8.2(R2) TP1.1
3V3_PER: R8.1(R1)
3V3_PWR_BRD: D5.A R12.2(R2)
3V3_USB_CHRG: C5.2(C2) D4.A R7.2(R2) R9.1(R1) U1.OUT
3V3_VDD: R5.1(R1) R10.2(R2)
5V: D2.C(K) D3.C(K)
5V_PWR_BRD: D3.A R4.2(R2)
5V_USB_CHRG: C1.2(C2) C4.1(C1) D1.C D2.A F1.2 R1.2(R2) U1.EN U1.IN
AGND: C10.1(C1) C11.1(C1) C12.1(C1) C13.1(C1) R13.1(R1)
GND: C1.1(C1) C2.1(C1) C3.1(C1) C4.2(C2) C5.1(C1) C6.1(C1) C7.1(C1) C8.1(C1) C9.1(C1) C14.1(C1) C15.1(C1) C16.1(C1) C17.1(C1) C18.1(C1) C19.1(C1) C20.1(C1) C21.1(C1) C22.1(C1) C23.1(C1) C24.1(C1) D1.A Dled1.2(K) Dled2.2(K) Dled3.2(K) Dled4.2(K) R11.2(R2) R13.2(R2) U1.GND
MCU_VDD: C2.2(C2) C14.2(C2) C15.2(C2) C16.2(C2) C17.2(C2) C18.2(C2) C19.2(C2) C20.2(C2) C21.2(C2) C22.2(C2) C23.2(C2) C24.2(C2) R2.2(R2) R6.2(R2) R10.1(R1)
VBAT: C9.2(C2) R6.1(R1)
VCAP: C7.2(C2) C8.2(C2)
VDDA: C3.2(C2) C10.2(C2) C11.2(C2) R2.1(R1) R3.2(R2)
VREF+: R3.1(R1)
VREFP: C12.2(C2) C13.2(C2) Pvrefp1.1 Pvrefp1.2
NetC6_2: C6.2(C2) R9.2(R2) R11.1(R1) U1.ADJ
NetDled1_1: Dled1.1(A) R1.1(R1)
NetDled2_1: Dled2.1(A) R4.1(R1)
NetDled3_1: Dled3.1(A) R7.1(R1)
NetDled4_1: Dled4.1(A) R12.1(R1)
NetF1_1: F1.1 ; port USB_FS_VBUS

### Notes on the sheet
- PWR SELECTION
- (near Dled1) 5V_USB_CHRG Active LED
- 3V3 USB PWR
- (near R5) IDD Measurement
- (near Dled2) 5V_PWR_BRD Active LED
- (near U1) 5V to 3V3 DC-DC converter
- IDD
- (near Dled3) 3V3_USB_CHRG Active LED
- (near Dled4) 3V3_PWR_BRD Active LED
- 2x2.2uF near VCAP pins / plan
- MCU DECAPS
- Ceramic capacitor (Low ESR, ESR<1ohm)
- capa near balls

### Library data of the parts
C1 = CAP 1000pF 50V: as C48 on sheet Mainboard_RMII_Interface; Package: 0603/0805; Value: 1000pF; Rating: 50V; Temperature Coefficient: X7R; Operating Temperature: -55°C ~ 125°C
C2 C3 C11 C13 C15-C24 = CAP 100nF 50V: as C27 on sheet Mainboard_Encoder_Interface; Package: 0805; Value: 100nF; Rating: 50V
C4 C9 C10 C12 = CAP 1uF 50V: CAP CER 1UF 50V X7R 0805; Tolerance: 10%; Package: 0805; Value: 1uF; Rating: 50V; Temperature Coefficient: X7R; Operating Temperature: -55°C ~ 125°C
C5 C7 C8 = CAP 2.2uF 35V: CAP CER 2.2UF 35V X7R 0603/0805; Tolerance: 10%; Package: 0603/0805; Value: 2.2uF; Rating: 35V; Temperature Coefficient: X7R; Operating Temperature: -55°C ~ 125°C
C6 = CAP 470pF 50V: as C40 on sheet Mainboard_RMII_Interface; Package: 0603/0805; Value: 470pF; Rating: 50V; Temperature Coefficient: X7R; Operating Temperature: -55°C ~ 125°C
C14 = CAP 4.7uF 35V: CAP CER 4.7UF 35V X7R 0603/0805; Tolerance: 10%; Package: 0603/0805; Value: 4.7uF; Rating: 35V; Temperature Coefficient: X7R; Operating Temperature: -55°C ~ 125°C
D1 = DIODE ZENER 2.8V 500mW: Zener Diode 2.8V 500mW ±5% Surface Mount SOD-123; Impedance (Max) (Zzt): 30 Ohms; Current - Reverse Leakage @ Vr: 75µA @ 1V; Voltage - Forward (Vf) (Max) @ If: 900mV @ 10mA; ComponentLink1Description: digikey; ComponentLink1URL: https://www.digikey.ca/en/products/detail/micro-commercial-co/MMSZ5245B-TP/1793206; Power - Max: 500mW; Voltage - Zener (Nom) (Vz): 2.8V
D2-D5 = DIODE SCHOTTKY 20V 1A: Diode Schottky 20V 1A Surface Mount SOD-123FL; MF: Micro Commercial Co; ComponentLink1Description: digikey; ComponentLink1URL: https://www.digikey.ca/product-detail/en/on-semiconductor/MBR0540T1G/MBR0540T1GOSCT-ND/917967; Digikey: SM5817PL-TPMSCT-ND; Digikey Link: https://www.digikey.ca/product-detail/en/micro-commercial-co/SM5817PL-TP/SM5817PL-TPMSCT-ND/1793410; MP: SM5817PL-TP; Voltage Rating: 20V; Package: SOD-123; Current Rating: 1A
Dled1-Dled4 = LED GREEN SMD: Typical RED, GREEN, YELLOW, AMBER GaAs LED; Voltage - Forward (Vf) (Typ): 2V; Lens Transparency: Clear; Current - Test: 20mA; Package: 1206; Color: Green
F1 = FUSE 3A 63V SLOW: FUSE 3A 63V AC/DC SLOW 1206; Response Time: Slow Blow; Current Rating (Amps): 3A; Operating Temperature: -55°C ~ 90°C; Voltage Rating - AC: 63V; Voltage Rating - DC: 63V
Pvrefp1 = Header 2: Header, 2-Pin; LatestRevisionDate: 17-Jul-2002; LatestRevisionNote: Re-released for DXP Platform.; Publisher: Altium Limited
R1 R4 = RES 270.0 1/8W: as R75 on sheet Mainboard_RMII_Interface; Package: 0805; Value: 270; Tolerance: 5%
R2 R3 R5 R6 R8 R10 R13 = RES 0 JUMPER: RES SMD 0 OHM JUMPER GENERIC 0805; Value: 0; Package: 0805
R7 R12 = RES 182.0 1/8W: RES SMD 182 OHM 1% 1/8W 0805; Power (Watts): 0.125W; Package: 0805; Value: 182; Tolerance: 1%
R9 = RES 100k 1/8W - 5%: RES SMD 100K OHM 5% 1/8W 0805; Power (Watts): 0.125W; Package: 0805; Value: 100k; Tolerance: 5%
R11 = RES 165k 1/4W: RES SMD 165K OHM 1% 1/4W 0805; Power (Watts): 0.25W; Package: 0805; Value: 165k; Tolerance: 1%
U1 = REG LIN POS ADJ: Linear Voltage Regulator IC  1 Output  500mA 8-SOIC; MF: Texas Instruments; MP: TL5209DR; Digikey: 296-21569-1-ND; Digikey Link: https://www.digikey.ca/product-detail/en/texas-instruments/TL5209DR/296-21569-1-ND/1427137; Price: 1.548 CAD; Rating: 500mA; Package: 8 SOIC; Supplier 1: Digi-Key; Supplier Part Number 1: 296-21569-1-ND